# EAGLE schematic Full (EAGLE 9.6.2)
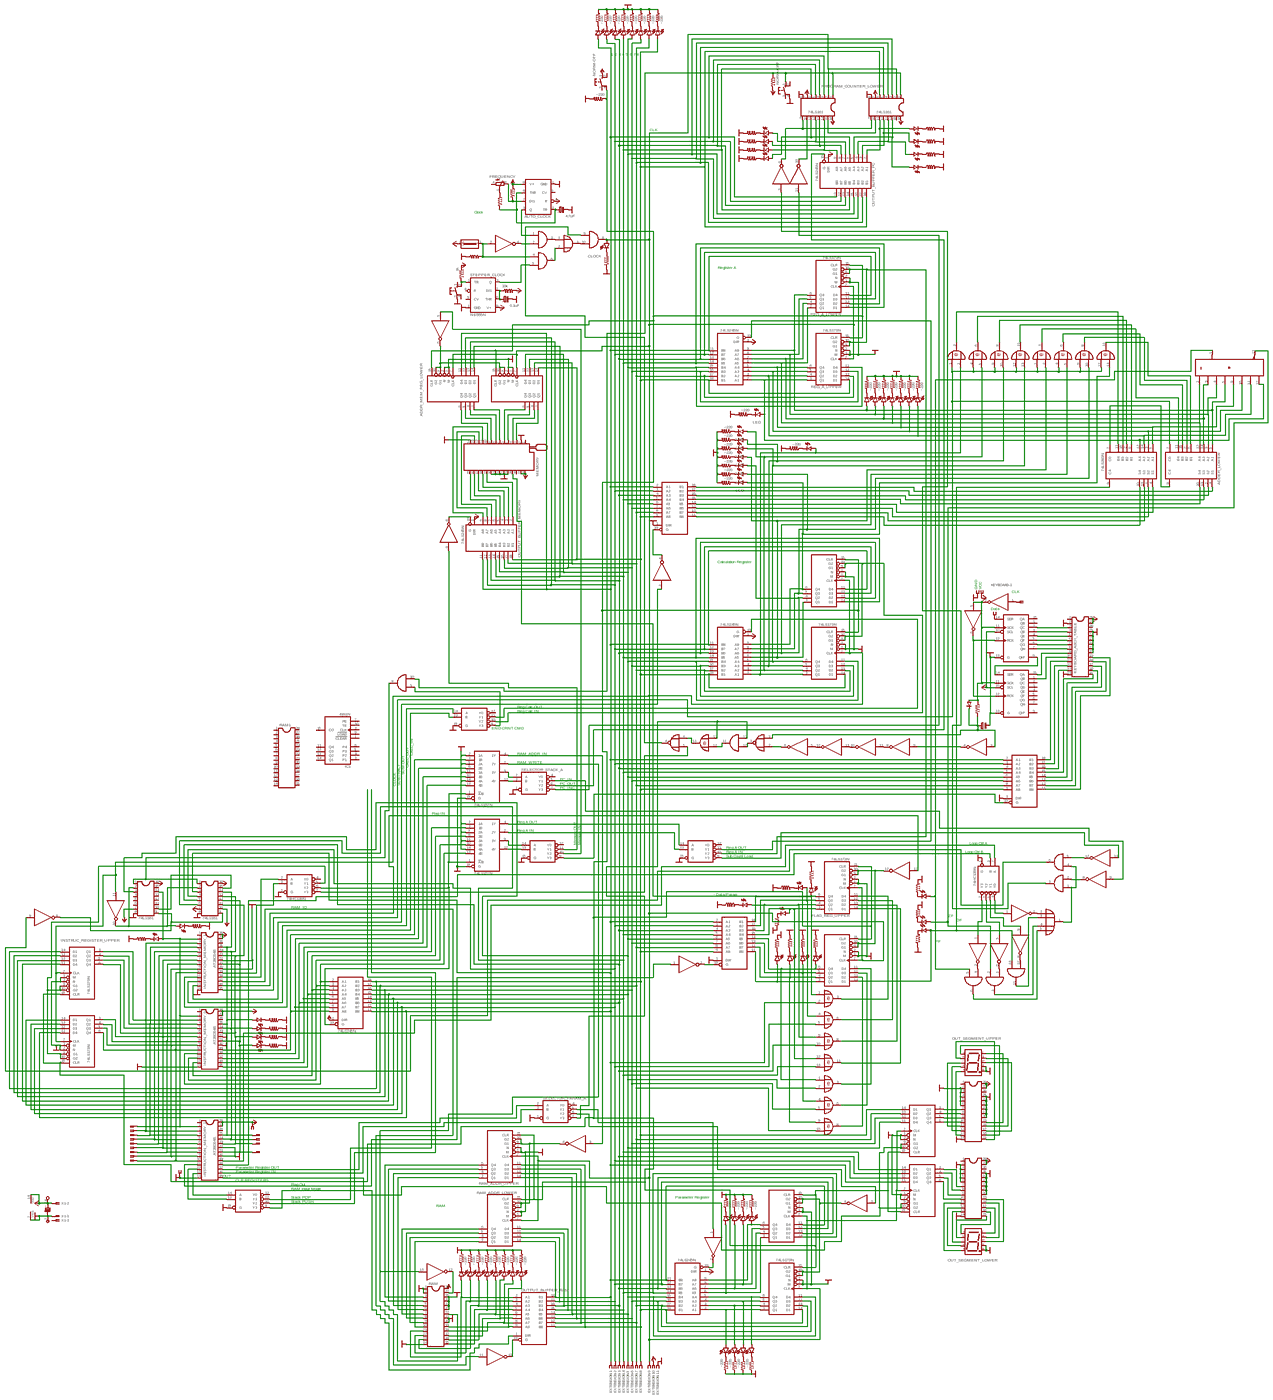
[diagram p0: schematic, sheet 1, overview]
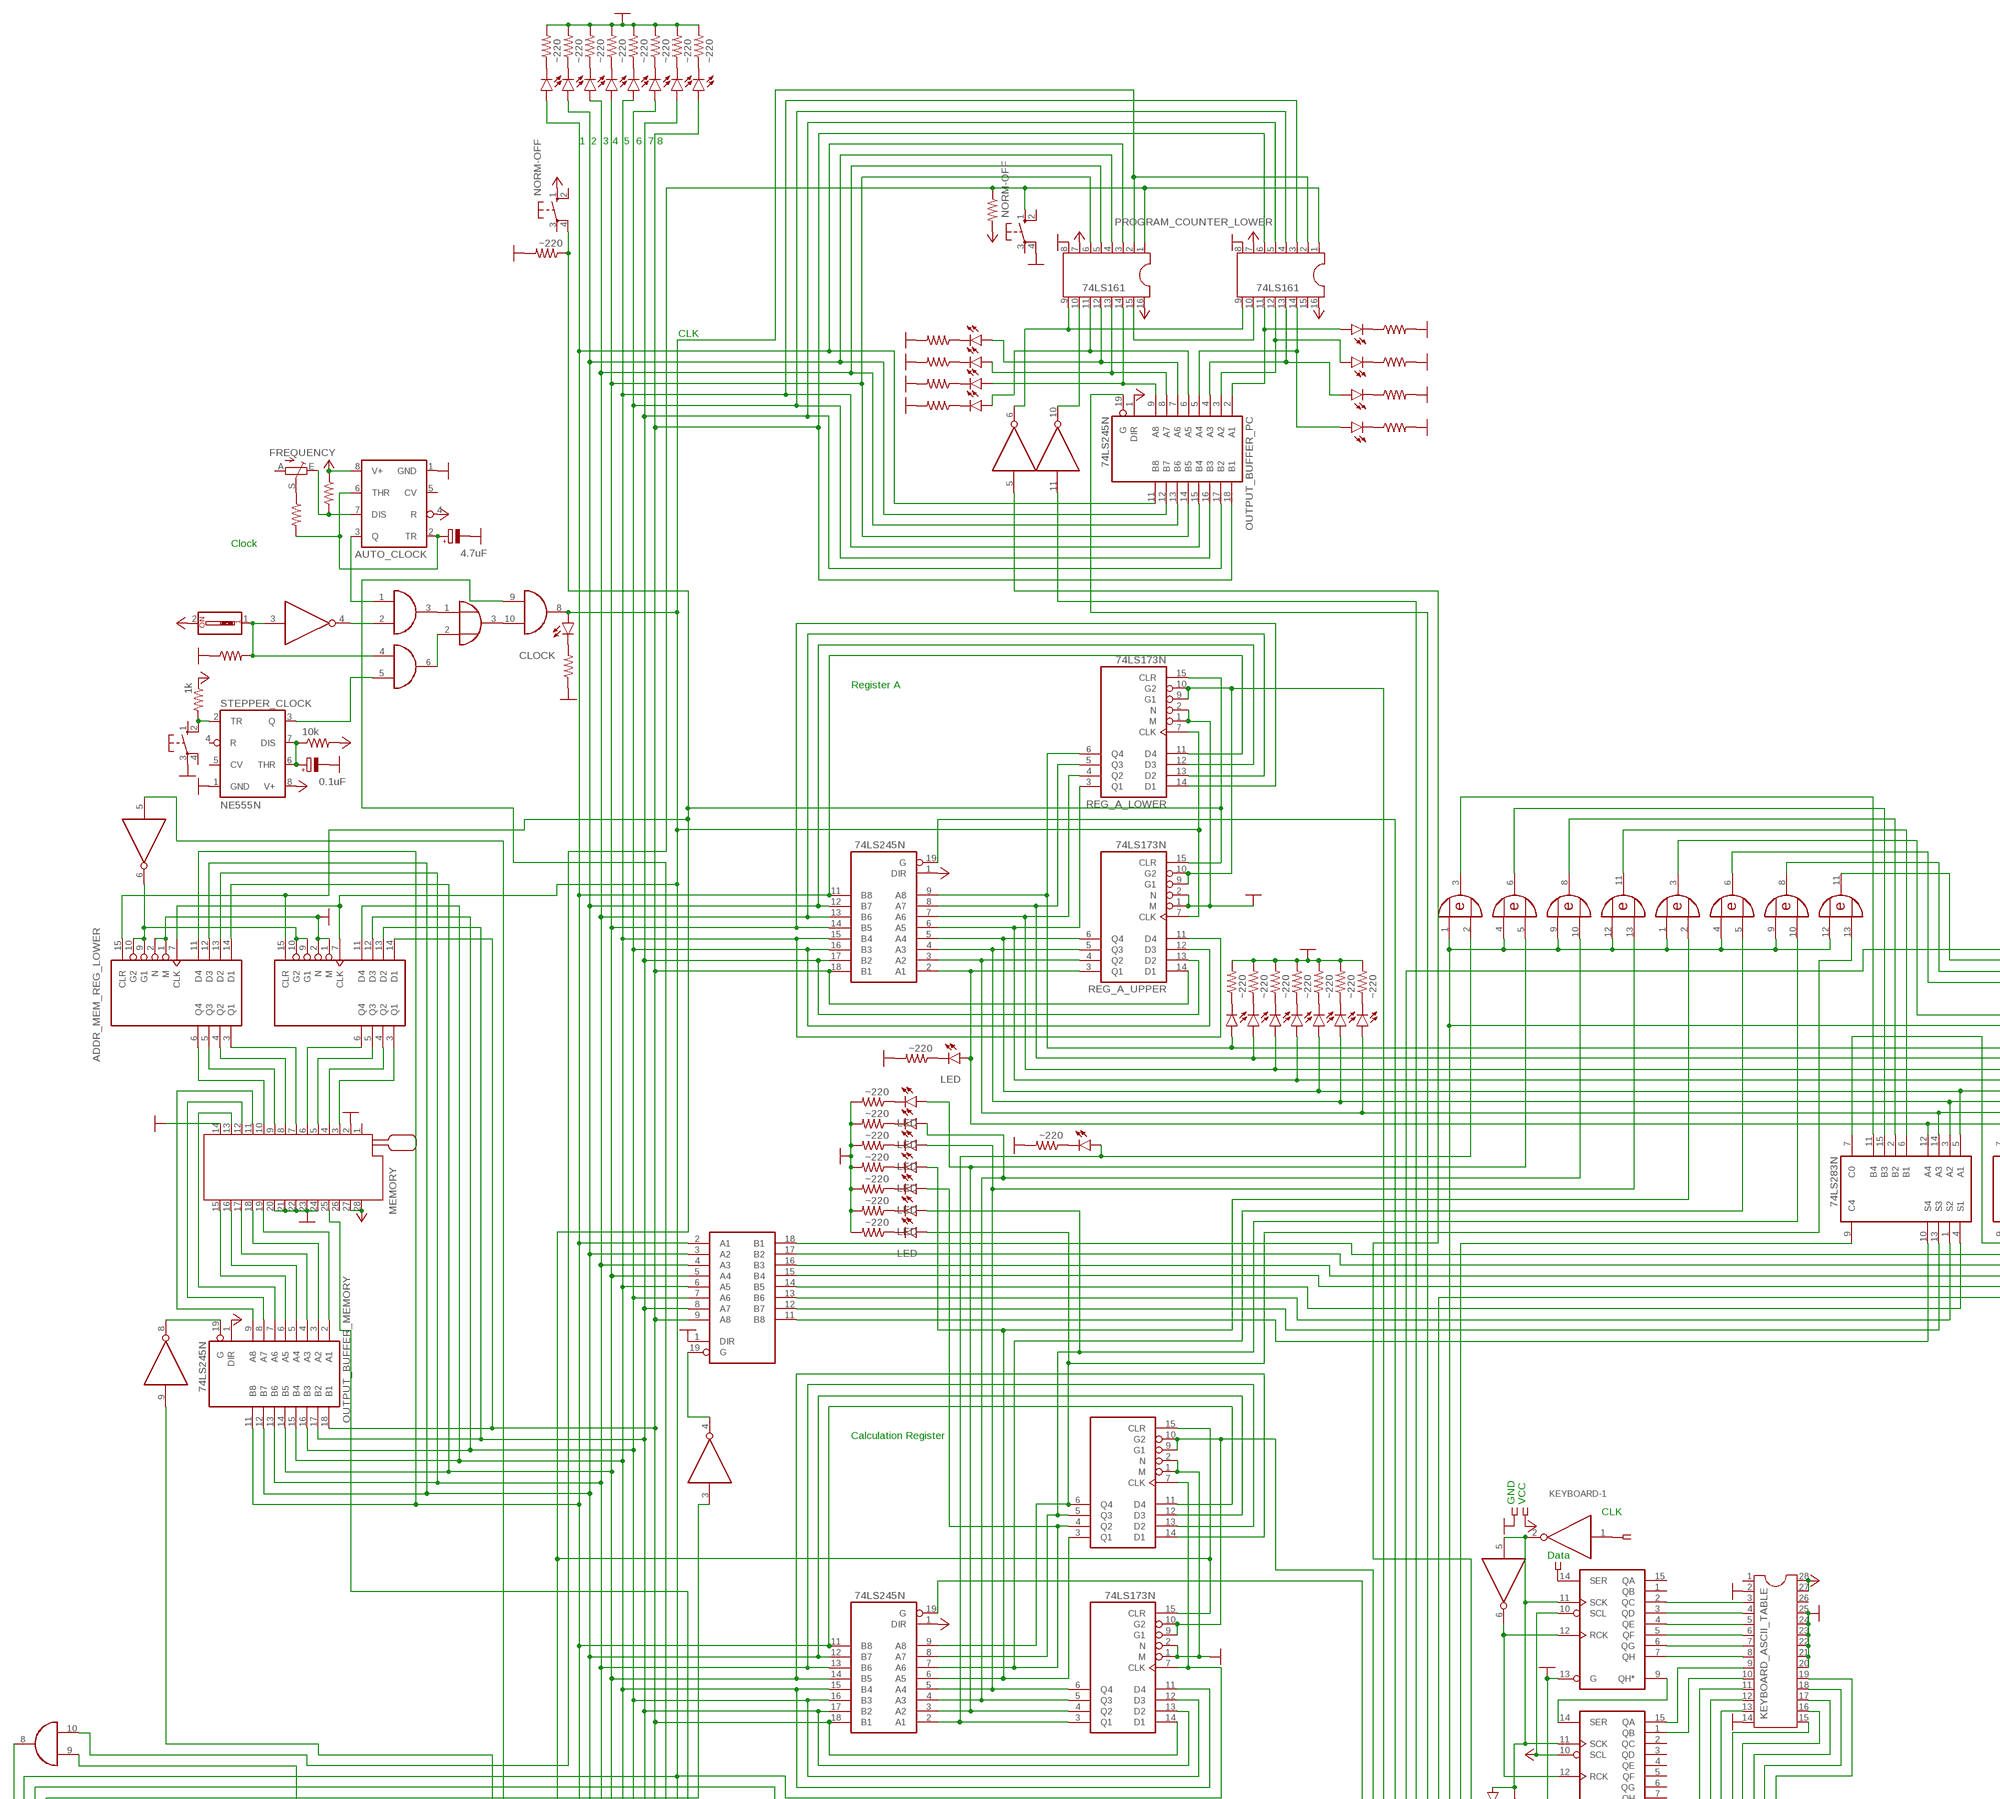
[diagram p1: schematic, sheet 1, part 1 of 4]
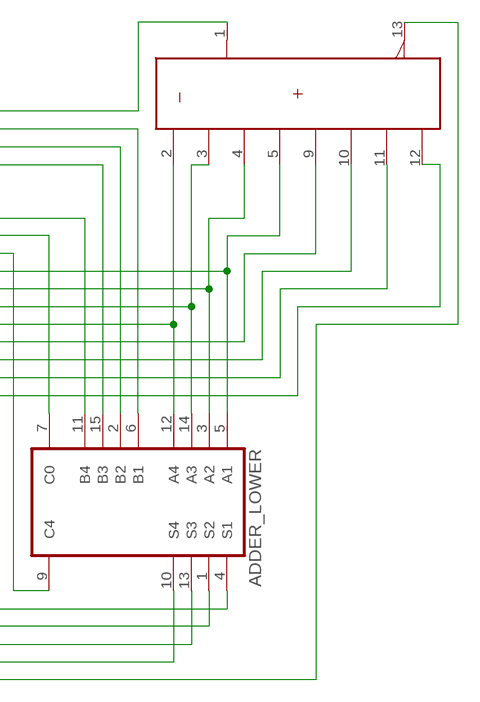
[diagram p2: schematic, sheet 1, part 2 of 4]
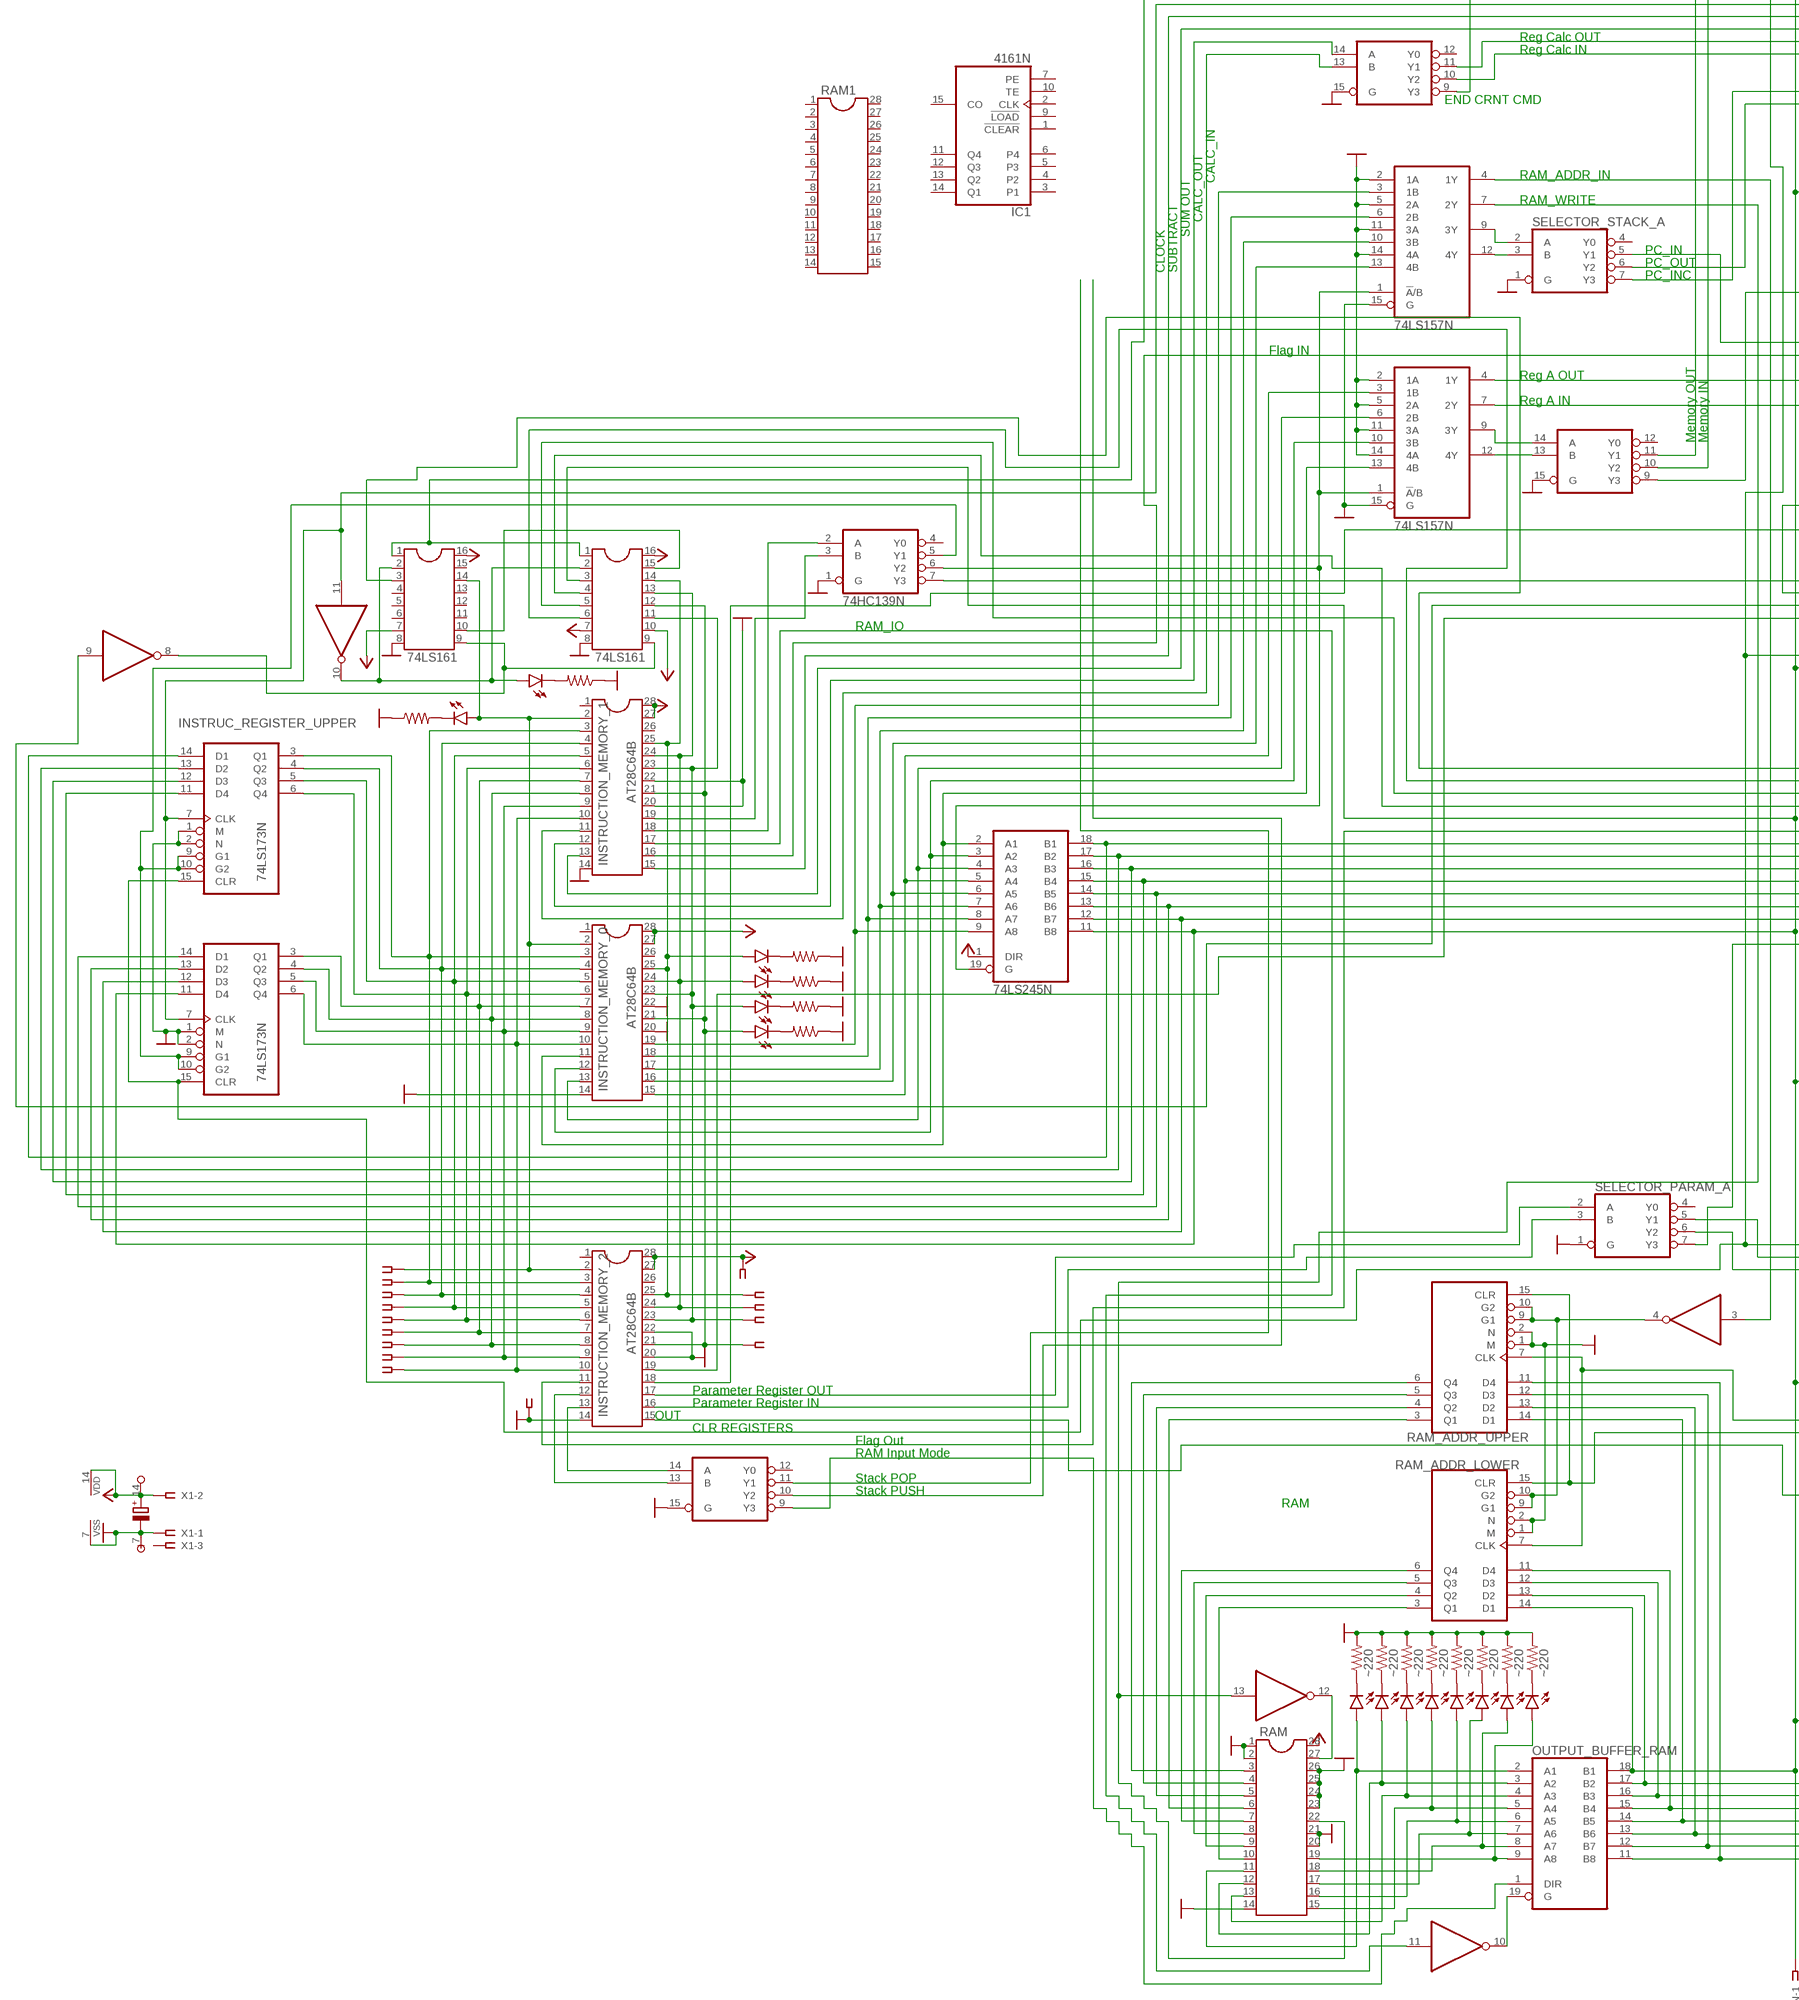
[diagram p3: schematic, sheet 1, part 3 of 4]
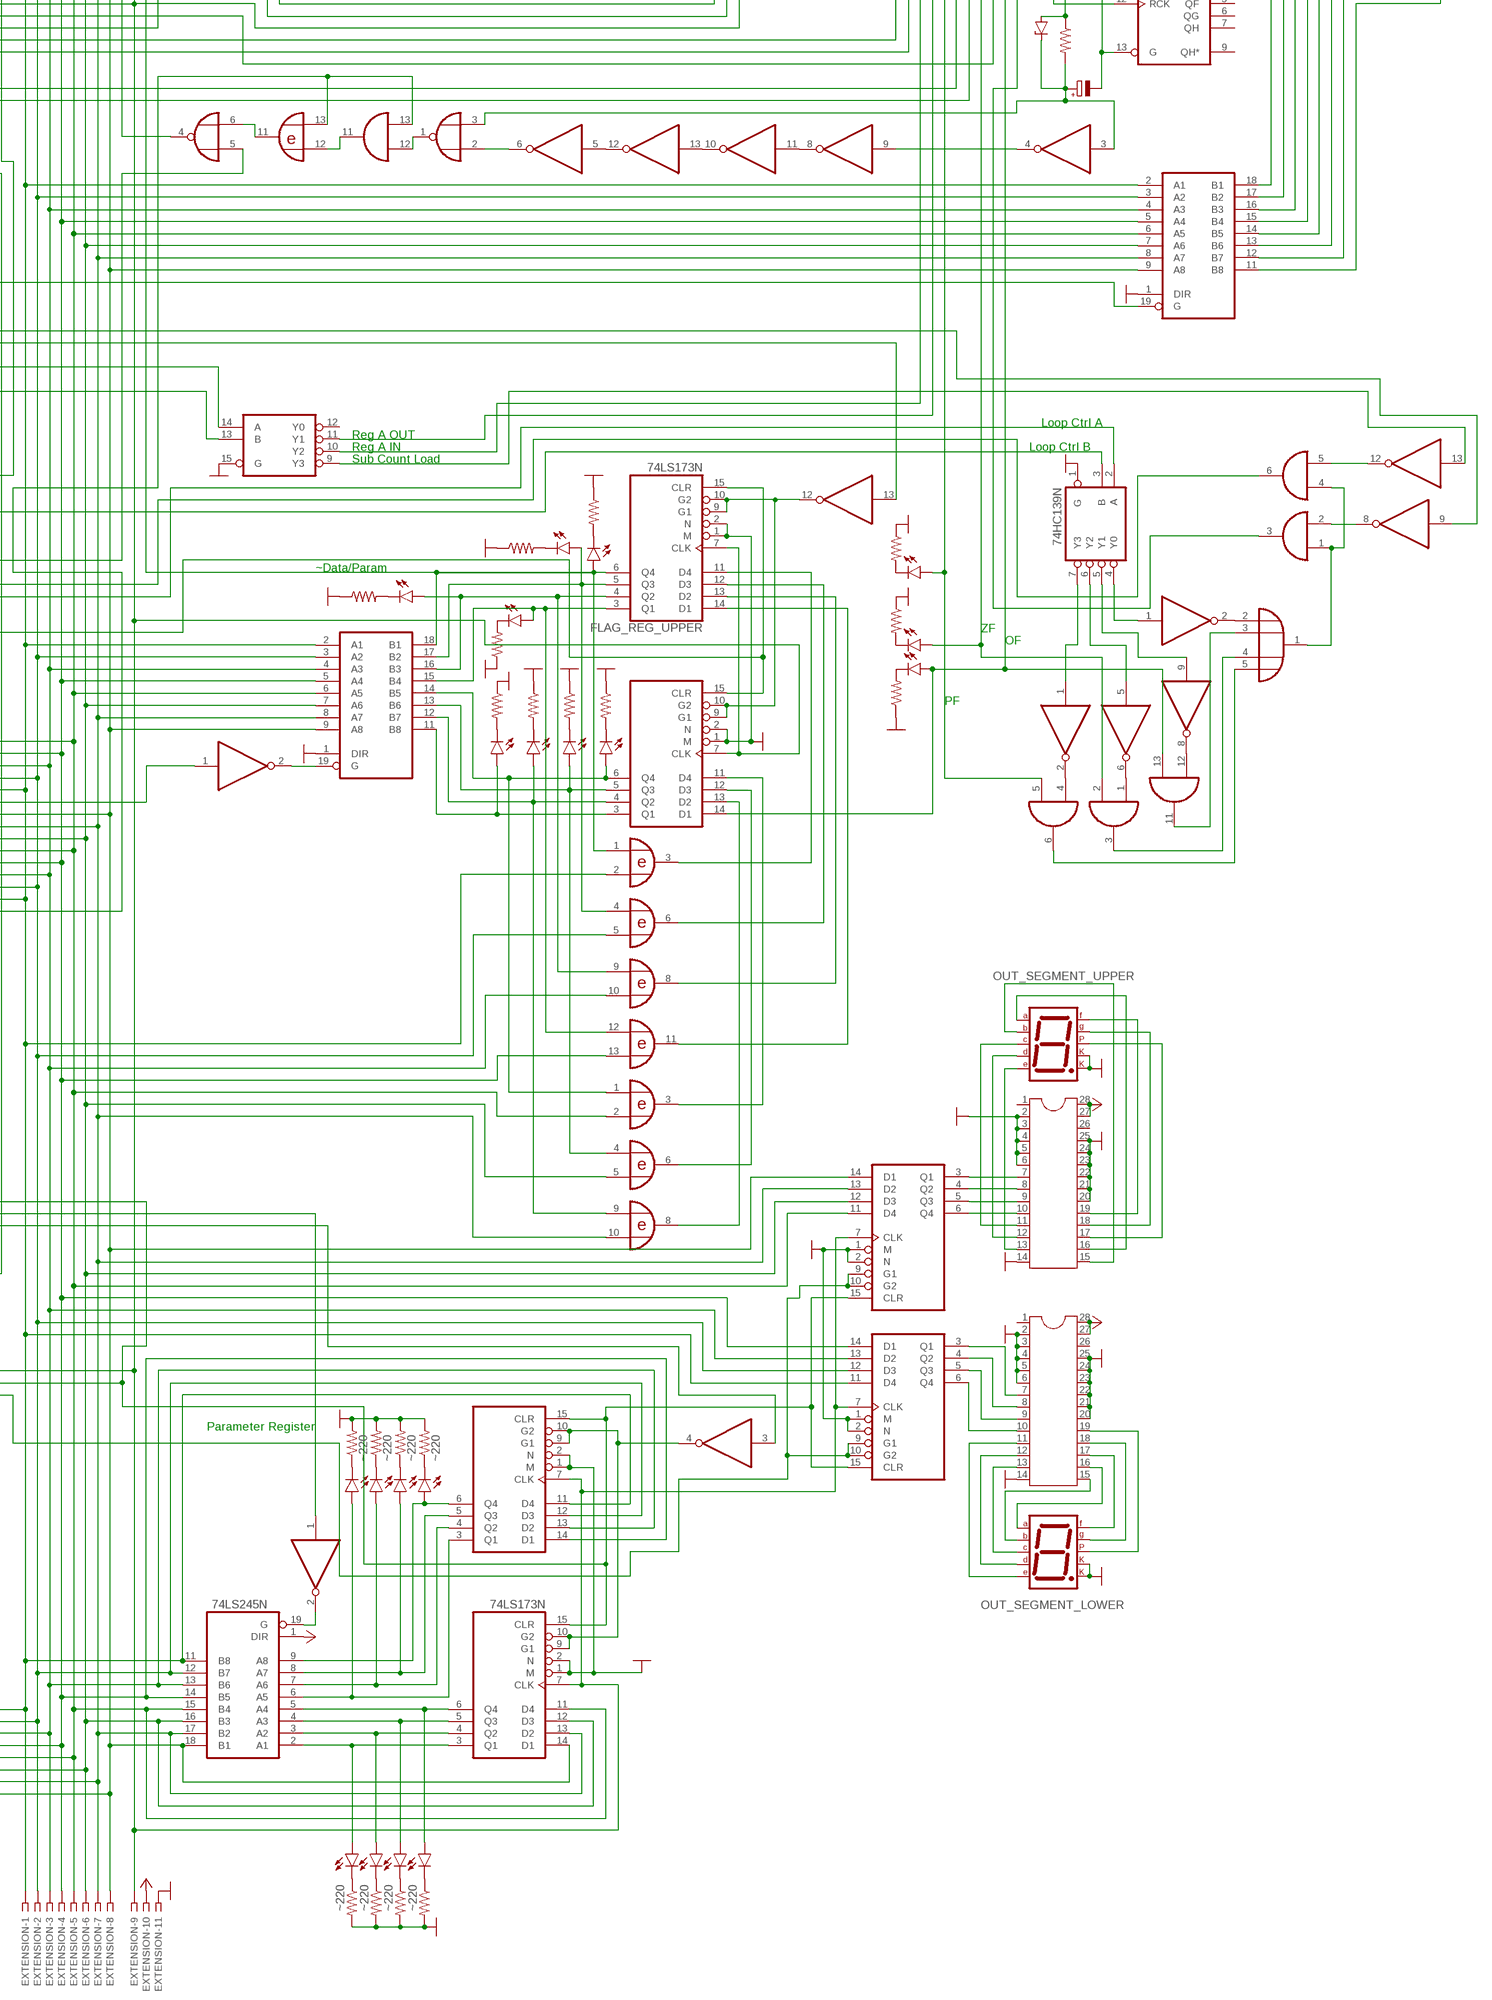
[diagram p4: schematic, sheet 1, part 4 of 4]

## Parts
4_INP_OR_GATE  4072N  [DIL14]
ADDER_LOWER  74LS283N  [DIL16]
ADDER_UPPER  74LS283N  [DIL16]
ADDR_MEM_REG_LOWER  74LS173N  [DIL16]
ADDR_MEM_REG_UPPER  74LS173N  [DIL16]
AND_GATE3_  74LS08N  [DIL14]
AND_GATE4_  74LS08N  [DIL14]
AND_GATE_  74LS08N  [DIL14]
AUTO_CLOCK  NE555N  [DIL08]
C1  4.7uF  CPOL-EUE2-5  [E2-5]
C2  0.1uF  CPOL-EUE2-5  [E2-5]
C3  0.1uF  CPOL-EUE2-5  [E2-5]
C4  0.1uF  CPOL-EUE2-5  [E2-5]
CLK_MODE  SWITCH  SW_DIP-1  [EDG-01]
CLK_TRIGGER  SWITCH  10-XX  [B3F-10XX]
CLOCK  Yellow  LED5MM  [LED5MM]
D1  1N4728  [DO41Z10]
DATABUS_1  LED  LED5MM  [LED5MM]
DATABUS_2  LED  LED5MM  [LED5MM]
DATABUS_3  LED  LED5MM  [LED5MM]
DATABUS_4  LED  LED5MM  [LED5MM]
DATABUS_5  LED  LED5MM  [LED5MM]
DATABUS_6  LED  LED5MM  [LED5MM]
DATABUS_7  LED  LED5MM  [LED5MM]
DATABUS_8  LED  LED5MM  [LED5MM]
EXTENSION  SSW-111-02-G-S  [SSW-111-02-G-S]
FLAG_1  LED  LED5MM  [LED5MM]
FLAG_2  LED  LED5MM  [LED5MM]
FLAG_3  LED  LED5MM  [LED5MM]
FLAG_4  LED  LED5MM  [LED5MM]
FLAG_5  LED  LED5MM  [LED5MM]
FLAG_6  LED  LED5MM  [LED5MM]
FLAG_7  LED  LED5MM  [LED5MM]
FLAG_8  LED  LED5MM  [LED5MM]
FLAG_REG_LOWER  74LS173N  [DIL16]
FLAG_REG_UPPER  74LS173N  [DIL16]
FREQUENCY  100k  TRIM_EU-RJ9W  [RJ9W]
IC1  4161N  [DIL16]
INSTRUC_REGISTER_LOWER  74LS173N  [DIL16]
INSTRUC_REGISTER_UPPER  74LS173N  [DIL16]
INSTRUCTION_MEMORY_0  AT28C64B  DIL28  [DIL28-6]
INSTRUCTION_MEMORY_1  AT28C64B  DIL28  [DIL28-6]
INSTRUCTION_MEMORY_2  AT28C64B  DIL28  [DIL28-6]
INSTRUCTIONS_EXTENSION  SSW-115-02-G-S  [SSW-115-02-G-S]
INVERTED_CLK_LED  LED  LED5MM  [LED5MM]
KEYBOARD  SSW-104-02-G-S  [SSW-104-02-G-S]
KEYBOARD_ASCII_TABLE  AT28C64B  DIL28  [DIL28-6]
KEYBOARD_SHIFT_LOWER  74LS595N  [DIL16]
KEYBOARD_SHIFT_UPPER  74LS595N  [DIL16]
LED_A_REG_1  LED  LED5MM  [LED5MM]
LED_A_REG_2  LED  LED5MM  [LED5MM]
LED_A_REG_3  LED  LED5MM  [LED5MM]
LED_A_REG_4  LED  LED5MM  [LED5MM]
LED_A_REG_5  LED  LED5MM  [LED5MM]
LED_A_REG_6  LED  LED5MM  [LED5MM]
LED_A_REG_7  LED  LED5MM  [LED5MM]
LED_A_REG_8  LED  LED5MM  [LED5MM]
LED_B_REG_1  LED  LED5MM  [LED5MM]
LED_B_REG_2  LED  LED5MM  [LED5MM]
LED_B_REG_3  LED  LED5MM  [LED5MM]
LED_B_REG_4  LED  LED5MM  [LED5MM]
LED_B_REG_5  LED  LED5MM  [LED5MM]
LED_B_REG_6  LED  LED5MM  [LED5MM]
LED_B_REG_7  LED  LED5MM  [LED5MM]
LED_B_REG_8  LED  LED5MM  [LED5MM]
MEMORY  228-1277-00-0602J  [228-1277-00-0602J]
MICRO_COUNTER_LOWER  74LS161  DIL16  [DIL16]
MICRO_COUNTER_UPPER  74LS161  DIL16  [DIL16]
NOR_GATE_  74LS02N  [DIL14]
NOT_GATE1_  74LS04N  [DIL14]
NOT_GATE2_  74LS04N  [DIL14]
NOT_GATE3_  74LS04N  [DIL14]
NOT_GATE4_  74LS04N  [DIL14]
NOT_GATE_  74LS04N  [DIL14]
OR_GATE_  74LS32N  [DIL14]
OUT_REG_LOWER  74LS173N  [DIL16]
OUT_REG_UPPER  74LS173N  [DIL16]
OUT_ROM_LOWER  AT28C64B  DIL28  [DIL28-6]
OUT_ROM_UPPER  AT28C64B  DIL28  [DIL28-6]
OUT_SEGMENT_LOWER  LED  7SEG-CK  [7SEG-13]
OUT_SEGMENT_UPPER  LED  7SEG-CK  [7SEG-13]
OUTPUT_BUFFER_ALU  74LS245N  [DIL20]
OUTPUT_BUFFER_CALC_REG  74LS245N  [DIL20]
OUTPUT_BUFFER_FLAGS  74HC245N  [DIL20]
OUTPUT_BUFFER_INSTRUCTION  74LS245N  [DIL20]
OUTPUT_BUFFER_KEYBOARD  74LS245N  [DIL20]
OUTPUT_BUFFER_MEMORY  74LS245N  [DIL20]
OUTPUT_BUFFER_PARAM_REG  74LS245N  [DIL20]
OUTPUT_BUFFER_PC  74LS245N  [DIL20]
OUTPUT_BUFFER_RAM  74HC245N  [DIL20]
OUTPUT_BUFFER_REG_A  74LS245N  [DIL20]
OVERFLOW_FLAG  LED  LED5MM  [LED5MM]
PARAM_LED_1  LED3MM  [LED3MM]
PARAM_LED_2  LED3MM  [LED3MM]
PARAM_LED_3  LED3MM  [LED3MM]
PARAM_LED_4  LED3MM  [LED3MM]
PARAM_LED_5  LED3MM  [LED3MM]
PARAM_LED_6  LED3MM  [LED3MM]
PARAM_LED_7  LED3MM  [LED3MM]
PARAM_LED_8  LED3MM  [LED3MM]
PC_1  LED5MM  [LED5MM]
PC_2  LED5MM  [LED5MM]
PC_3  LED5MM  [LED5MM]
PC_4  LED5MM  [LED5MM]
PC_5  LED5MM  [LED5MM]
PC_6  LED5MM  [LED5MM]
PC_7  LED5MM  [LED5MM]
PC_8  LED5MM  [LED5MM]
POSITIVE_FLAG  LED  LED5MM  [LED5MM]
PROGRAM_COUNTER_LOWER  74LS161  DIL16  [DIL16]
PROGRAM_COUNTER_UPPER  74LS161  DIL16  [DIL16]
R1  1k  R-US_0204/7  [0204/7]
R2  1k  R-US_0204/7  [0204/7]
R3  10k  R-US_0204/7  [0204/7]
R4  220  R-US_0204/7  [0204/7]
R5  ~220  R-US_0204/7  [0204/7]
R6  ~220  R-US_0204/7  [0204/7]
R7  220  R-US_0204/7  [0204/7]
R8  ~220  R-US_0204/7  [0204/7]
R9  ~220  R-US_0204/7  [0204/7]
R10  ~220  R-US_0204/7  [0204/7]
R11  ~220  R-US_0204/7  [0204/7]
R12  ~220  R-US_0204/7  [0204/7]
R13  ~220  R-US_0204/7  [0204/7]
R14  ~220  R-US_0204/7  [0204/7]
R15  ~220  R-US_0204/7  [0204/7]
R16  ~220  R-US_0204/7  [0204/7]
R17  ~220  R-US_0204/7  [0204/7]
R18  ~220  R-US_0204/7  [0204/7]
R19  ~220  R-US_0204/7  [0204/7]
R20  ~220  R-US_0204/7  [0204/7]
R21  ~220  R-US_0204/7  [0204/7]
R22  ~220  R-US_0204/7  [0204/7]
R23  ~220  R-US_0204/7  [0204/7]
R24  ~220  R-US_0204/7  [0204/7]
R25  ~220  R-US_0204/7  [0204/7]
R26  ~220  R-US_0204/7  [0204/7]
R27  ~220  R-US_0204/7  [0204/7]
R28  ~220  R-US_0204/7  [0204/7]
R29  ~220  R-US_0204/7  [0204/7]
R30  ~220  R-US_0204/7  [0204/7]
R31  ~220  R-US_0204/7  [0204/7]
R32  ~220  R-US_0204/7  [0204/7]
R33  ~220  R-US_0204/7  [0204/7]
R34  ~220  R-US_0204/7  [0204/7]
R35  ~220  R-US_0204/7  [0204/7]
R36  ~220  R-US_0204/7  [0204/7]
R37  ~220  R-US_0204/7  [0204/7]
R38  ~220  R-US_0204/7  [0204/7]
R39  ~220  R-US_0204/7  [0204/7]
R40  ~220  R-US_0204/7  [0204/7]
R41  ~220  R-US_0204/7  [0204/7]
R42  ~220  R-US_0204/7  [0204/7]
R43  ~220  R-US_0204/7  [0204/7]
R44  ~220  R-US_0204/7  [0204/7]
R45  ~220  R-US_0204/7  [0204/7]
R53  ~220  R-US_0204/7  [0204/7]
R54  ~220  R-US_0204/7  [0204/7]
R55  ~220  R-US_0204/7  [0204/7]
R56  ~220  R-US_0204/7  [0204/7]
R57  ~220  R-US_0204/7  [0204/7]
R58  ~220  R-US_0204/7  [0204/7]
R59  ~220  R-US_0204/7  [0204/7]
R60  ~220  R-US_0204/7  [0204/7]
R61  ~220  R-US_0204/7  [0204/7]
R62  ~220  R-US_0204/7  [0204/7]
R63  ~220  R-US_0204/7  [0204/7]
R64  ~220  R-US_0204/7  [0204/7]
R65  ~220  R-US_0204/7  [0204/7]
R66  ~220  R-US_0204/7  [0204/7]
R67  ~220  R-US_0204/7  [0204/7]
R68  ~220  R-US_0204/7  [0204/7]
R69  ~220  R-US_0204/7  [0204/7]
R70  ~220  R-US_0204/7  [0204/7]
R71  ~220  R-US_0204/7  [0204/7]
R72  ~220  R-US_0204/7  [0204/7]
R73  ~220  R-US_0204/7  [0204/7]
R74  ~220  R-US_0204/7  [0204/7]
R75  ~220  R-US_0204/7  [0204/7]
R76  ~220  R-US_0204/7  [0204/7]
R77  ~220  R-US_0204/7  [0204/7]
R78  ~220  R-US_0204/7  [0204/7]
R79  ~220  R-US_0204/7  [0204/7]
R80  ~220  R-US_0204/7  [0204/7]
R81  ~220  R-US_0204/7  [0204/7]
RAM  71256SA15TPG  DIL28-3  [DIL28-3]
RAM1  71256SA15TPG  DIL28-3  [DIL28-3]
RAM_ADDR_LOWER  74LS173N  [DIL16]
RAM_ADDR_UPPER  74LS173N  [DIL16]
RAM_LED_1  LED3MM  [LED3MM]
RAM_LED_2  LED3MM  [LED3MM]
RAM_LED_3  LED3MM  [LED3MM]
RAM_LED_4  LED3MM  [LED3MM]
RAM_LED_5  LED3MM  [LED3MM]
RAM_LED_6  LED3MM  [LED3MM]
RAM_LED_7  LED3MM  [LED3MM]
RAM_LED_8  LED3MM  [LED3MM]
REG_A_LOWER  74LS173N  [DIL16]
REG_A_UPPER  74LS173N  [DIL16]
REG_CALC_LOWER  74LS173N  [DIL16]
REG_CALC_UPPER  74LS173N  [DIL16]
REG_PARAM_LOWER  74LS173N  [DIL16]
REG_PARAM_UPPER  74LS173N  [DIL16]
RESET_PC  NORM-OFF  10-XX  [B3F-10XX]
RESET_REGS  NORM-OFF  10-XX  [B3F-10XX]
SELECTOR_BRANCH_  74HC139N  [DIL16]
SELECTOR_INSRUCTION_LOWER  74LS157N  [DIL16]
SELECTOR_INSRUCTION_UPPER  74LS157N  [DIL16]
SELECTOR_LOGIC_  74HC139N  [DIL16]
SELECTOR_PARAM_  74LS139N  [DIL16]
SELECTOR_STACK_  74LS139N  [DIL16]
STEPPER_CLOCK  NE555N  [DIL08]
SUBTRACT_INVRTR_LOWER_  74LS86N  [DIL14]
SUBTRACT_INVRTR_UPPER_  74LS86N  [DIL14]
USTEP_1  LED  LED5MM  [LED5MM]
USTEP_2  LED  LED5MM  [LED5MM]
USTEP_3  LED  LED5MM  [LED5MM]
USTEP_4  LED  LED5MM  [LED5MM]
USTEP_5  LED  LED5MM  [LED5MM]
X1  SSW-103-02-G-S  [SSW-103-02-G-S]
XOR_GATE_1  74LS86N  [DIL14]
XOR_GATE_2  74LS86N  [DIL14]
ZERO_FLAG  220  LED5MM  [LED5MM]
ZERO_POS_FLAG_IDENTIFIER  744078N  [DIL14]

## Nets
1_PLACE1 [Databus]: ADDR_MEM_REG_LOWER.11(D4) DATABUS_1.A EXTENSION.1 INSTRUC_REGISTER_LOWER.11(D4) MICRO_COUNTER_LOWER.3 OUT_REG_LOWER.11(D4) OUTPUT_BUFFER_ALU.2(A1) OUTPUT_BUFFER_CALC_REG.11(B8) OUTPUT_BUFFER_FLAGS.2(A1) OUTPUT_BUFFER_INSTRUCTION.11(B8) OUTPUT_BUFFER_KEYBOARD.2(A1) OUTPUT_BUFFER_MEMORY.11(B8) OUTPUT_BUFFER_PARAM_REG.11(B8) OUTPUT_BUFFER_PC.11(B8) OUTPUT_BUFFER_RAM.18(B1) OUTPUT_BUFFER_REG_A.11(B8) PROGRAM_COUNTER_LOWER.3 RAM_ADDR_LOWER.14(D1) REG_A_LOWER.11(D4) REG_CALC_LOWER.11(D4) REG_PARAM_LOWER.11(D4) XOR_GATE_1.2(A:I1)
2_PLACE [Databus]: ADDR_MEM_REG_LOWER.12(D3) DATABUS_2.A EXTENSION.2 INSTRUC_REGISTER_LOWER.12(D3) MICRO_COUNTER_LOWER.4 OUT_REG_LOWER.12(D3) OUTPUT_BUFFER_ALU.3(A2) OUTPUT_BUFFER_CALC_REG.12(B7) OUTPUT_BUFFER_FLAGS.3(A2) OUTPUT_BUFFER_INSTRUCTION.12(B7) OUTPUT_BUFFER_KEYBOARD.3(A2) OUTPUT_BUFFER_MEMORY.12(B7) OUTPUT_BUFFER_PARAM_REG.12(B7) OUTPUT_BUFFER_PC.12(B7) OUTPUT_BUFFER_RAM.17(B2) OUTPUT_BUFFER_REG_A.12(B7) PROGRAM_COUNTER_LOWER.4 RAM_ADDR_LOWER.13(D2) REG_A_LOWER.12(D3) REG_CALC_LOWER.12(D3) REG_PARAM_LOWER.12(D3) XOR_GATE_1.5(B:I1)
4_PLACE [Databus]: ADDR_MEM_REG_LOWER.13(D2) DATABUS_3.A EXTENSION.3 INSTRUC_REGISTER_LOWER.13(D2) MICRO_COUNTER_LOWER.5 OUT_REG_LOWER.13(D2) OUTPUT_BUFFER_ALU.4(A3) OUTPUT_BUFFER_CALC_REG.13(B6) OUTPUT_BUFFER_FLAGS.4(A3) OUTPUT_BUFFER_INSTRUCTION.13(B6) OUTPUT_BUFFER_KEYBOARD.4(A3) OUTPUT_BUFFER_MEMORY.13(B6) OUTPUT_BUFFER_PARAM_REG.13(B6) OUTPUT_BUFFER_PC.13(B6) OUTPUT_BUFFER_RAM.16(B3) OUTPUT_BUFFER_REG_A.13(B6) PROGRAM_COUNTER_LOWER.5 RAM_ADDR_LOWER.12(D3) REG_A_LOWER.13(D2) REG_CALC_LOWER.13(D2) REG_PARAM_LOWER.13(D2) XOR_GATE_1.10(C:I1)
8_PLACE [Databus]: ADDR_MEM_REG_LOWER.14(D1) DATABUS_4.A EXTENSION.4 INSTRUC_REGISTER_LOWER.14(D1) MICRO_COUNTER_LOWER.6 OUT_REG_LOWER.14(D1) OUTPUT_BUFFER_ALU.5(A4) OUTPUT_BUFFER_CALC_REG.14(B5) OUTPUT_BUFFER_FLAGS.5(A4) OUTPUT_BUFFER_INSTRUCTION.14(B5) OUTPUT_BUFFER_KEYBOARD.5(A4) OUTPUT_BUFFER_MEMORY.14(B5) OUTPUT_BUFFER_PARAM_REG.14(B5) OUTPUT_BUFFER_PC.14(B5) OUTPUT_BUFFER_RAM.15(B4) OUTPUT_BUFFER_REG_A.14(B5) PROGRAM_COUNTER_LOWER.6 RAM_ADDR_LOWER.11(D4) REG_A_LOWER.14(D1) REG_CALC_LOWER.14(D1) REG_PARAM_LOWER.14(D1) XOR_GATE_1.13(D:I1)
16_PLACE [Databus]: ADDR_MEM_REG_UPPER.11(D4) DATABUS_5.A EXTENSION.5 INSTRUC_REGISTER_UPPER.11(D4) MICRO_COUNTER_UPPER.3 OUT_REG_UPPER.11(D4) OUTPUT_BUFFER_ALU.6(A5) OUTPUT_BUFFER_CALC_REG.15(B4) OUTPUT_BUFFER_FLAGS.6(A5) OUTPUT_BUFFER_INSTRUCTION.15(B4) OUTPUT_BUFFER_KEYBOARD.6(A5) OUTPUT_BUFFER_MEMORY.15(B4) OUTPUT_BUFFER_PARAM_REG.15(B4) OUTPUT_BUFFER_PC.15(B4) OUTPUT_BUFFER_RAM.14(B5) OUTPUT_BUFFER_REG_A.15(B4) PROGRAM_COUNTER_UPPER.3 RAM_ADDR_UPPER.14(D1) REG_A_UPPER.11(D4) REG_CALC_UPPER.11(D4) REG_PARAM_UPPER.11(D4) XOR_GATE_2.2(A:I1)
32_PLACE [Databus]: ADDR_MEM_REG_UPPER.12(D3) DATABUS_6.A EXTENSION.6 INSTRUC_REGISTER_UPPER.12(D3) OUT_REG_UPPER.12(D3) OUTPUT_BUFFER_ALU.7(A6) OUTPUT_BUFFER_CALC_REG.16(B3) OUTPUT_BUFFER_FLAGS.7(A6) OUTPUT_BUFFER_INSTRUCTION.16(B3) OUTPUT_BUFFER_KEYBOARD.7(A6) OUTPUT_BUFFER_MEMORY.16(B3) OUTPUT_BUFFER_PARAM_REG.16(B3) OUTPUT_BUFFER_PC.16(B3) OUTPUT_BUFFER_RAM.13(B6) OUTPUT_BUFFER_REG_A.16(B3) PROGRAM_COUNTER_UPPER.4 RAM_ADDR_UPPER.13(D2) REG_A_UPPER.12(D3) REG_CALC_UPPER.12(D3) REG_PARAM_UPPER.12(D3) XOR_GATE_2.5(B:I1)
64_PLACE [Databus]: ADDR_MEM_REG_UPPER.13(D2) DATABUS_7.A EXTENSION.7 INSTRUC_REGISTER_UPPER.13(D2) OUT_REG_UPPER.13(D2) OUTPUT_BUFFER_ALU.8(A7) OUTPUT_BUFFER_CALC_REG.17(B2) OUTPUT_BUFFER_FLAGS.8(A7) OUTPUT_BUFFER_INSTRUCTION.17(B2) OUTPUT_BUFFER_KEYBOARD.8(A7) OUTPUT_BUFFER_MEMORY.17(B2) OUTPUT_BUFFER_PARAM_REG.17(B2) OUTPUT_BUFFER_PC.17(B2) OUTPUT_BUFFER_RAM.12(B7) OUTPUT_BUFFER_REG_A.17(B2) PROGRAM_COUNTER_UPPER.5 RAM_ADDR_UPPER.12(D3) REG_A_UPPER.13(D2) REG_CALC_UPPER.13(D2) REG_PARAM_UPPER.13(D2) XOR_GATE_2.10(C:I1)
128_PLACE [Databus]: ADDR_MEM_REG_UPPER.14(D1) DATABUS_8.A EXTENSION.8 INSTRUC_REGISTER_UPPER.14(D1) OUT_REG_UPPER.14(D1) OUTPUT_BUFFER_ALU.9(A8) OUTPUT_BUFFER_CALC_REG.18(B1) OUTPUT_BUFFER_FLAGS.9(A8) OUTPUT_BUFFER_INSTRUCTION.18(B1) OUTPUT_BUFFER_KEYBOARD.9(A8) OUTPUT_BUFFER_MEMORY.18(B1) OUTPUT_BUFFER_PARAM_REG.18(B1) OUTPUT_BUFFER_PC.18(B1) OUTPUT_BUFFER_RAM.11(B8) OUTPUT_BUFFER_REG_A.18(B1) PROGRAM_COUNTER_UPPER.6 RAM_ADDR_UPPER.11(D4) REG_A_UPPER.14(D1) REG_CALC_UPPER.14(D1) REG_PARAM_UPPER.14(D1)
>0_FLAG: AND_GATE4_.5(B:I1) POSITIVE_FLAG.A ZERO_POS_FLAG_IDENTIFIER.1(Y)
CALC_IN: REG_CALC_LOWER.9(G1) REG_CALC_LOWER.10(G2) REG_CALC_UPPER.9(G1) REG_CALC_UPPER.10(G2) SELECTOR_LOGIC_.10(B:Y2)
CALC_OUT: OUTPUT_BUFFER_CALC_REG.19(G) SELECTOR_LOGIC_.11(B:Y1)
CLOCK: ADDR_MEM_REG_LOWER.7(CLK) ADDR_MEM_REG_UPPER.7(CLK) AND_GATE_.8(C:O) CLOCK.A EXTENSION.9 FLAG_REG_LOWER.7(CLK) FLAG_REG_UPPER.7(CLK) INSTRUC_REGISTER_LOWER.7(CLK) INSTRUC_REGISTER_UPPER.7(CLK) NOT_GATE1_.11(E:I) OUT_REG_LOWER.7(CLK) OUT_REG_UPPER.7(CLK) PROGRAM_COUNTER_LOWER.2 PROGRAM_COUNTER_UPPER.2 RAM_ADDR_LOWER.7(CLK) RAM_ADDR_UPPER.7(CLK) REG_A_LOWER.7(CLK) REG_A_UPPER.7(CLK) REG_CALC_LOWER.7(CLK) REG_CALC_UPPER.7(CLK) REG_PARAM_LOWER.7(CLK) REG_PARAM_UPPER.7(CLK)
CLR_REG: ADDR_MEM_REG_LOWER.15(CLR) ADDR_MEM_REG_UPPER.15(CLR) FLAG_REG_LOWER.15(CLR) FLAG_REG_UPPER.15(CLR) INSTRUC_REGISTER_LOWER.15(CLR) INSTRUC_REGISTER_UPPER.15(CLR) OUT_REG_LOWER.15(CLR) OUT_REG_UPPER.15(CLR) R81.1 RAM_ADDR_LOWER.15(CLR) RAM_ADDR_UPPER.15(CLR) REG_A_LOWER.15(CLR) REG_A_UPPER.15(CLR) REG_CALC_LOWER.15(CLR) REG_CALC_UPPER.15(CLR) REG_PARAM_LOWER.15(CLR) REG_PARAM_UPPER.15(CLR) RESET_REGS.4(P1)
COUNTERS_CLEAR: AND_GATE3_.10(C:I1) PROGRAM_COUNTER_LOWER.1 PROGRAM_COUNTER_UPPER.1 R80.1 RESET_PC.1(S)
CTRL_SIG_1: INSTRUCTION_MEMORY_0.11 OUTPUT_BUFFER_INSTRUCTION.2(A1) SELECTOR_INSRUCTION_LOWER.13(4B)
CTRL_SIG_2: INSTRUCTION_MEMORY_0.12 OUTPUT_BUFFER_INSTRUCTION.3(A2) SELECTOR_INSRUCTION_LOWER.10(3B)
CTRL_SIG_3: INSTRUCTION_MEMORY_0.13 OUTPUT_BUFFER_INSTRUCTION.4(A3) SELECTOR_INSRUCTION_LOWER.6(2B)
CTRL_SIG_4: INSTRUCTION_MEMORY_0.15 OUTPUT_BUFFER_INSTRUCTION.5(A4) SELECTOR_INSRUCTION_LOWER.3(1B)
CTRL_SIG_5: INSTRUCTION_MEMORY_0.16 OUTPUT_BUFFER_INSTRUCTION.6(A5) SELECTOR_INSRUCTION_UPPER.13(4B)
CTRL_SIG_6: INSTRUCTION_MEMORY_0.17 OUTPUT_BUFFER_INSTRUCTION.7(A6) SELECTOR_INSRUCTION_UPPER.10(3B)
CTRL_SIG_7: INSTRUCTION_MEMORY_0.18 OUTPUT_BUFFER_INSTRUCTION.8(A7) SELECTOR_INSRUCTION_UPPER.6(2B)
CTRL_SIG_8: INSTRUCTION_MEMORY_0.19 OUTPUT_BUFFER_INSTRUCTION.9(A8) SELECTOR_INSRUCTION_UPPER.3(1B)
CTRL_SIG_9: INSTRUCTION_MEMORY_1.11 SELECTOR_LOGIC_.13(B:B)
CTRL_SIG_10: INSTRUCTION_MEMORY_1.12 SELECTOR_LOGIC_.14(B:A)
CTRL_SIG_11: INSTRUCTION_MEMORY_1.13 NOT_GATE3_.3(B:I)
CTRL_SIG_12: ADDER_LOWER.7(C0) INSTRUCTION_MEMORY_1.15 SUBTRACT_INVRTR_LOWER_.1(A:I0) SUBTRACT_INVRTR_LOWER_.4(B:I0) SUBTRACT_INVRTR_LOWER_.9(C:I0) SUBTRACT_INVRTR_LOWER_.12(D:I0) SUBTRACT_INVRTR_UPPER_.1(A:I0) SUBTRACT_INVRTR_UPPER_.4(B:I0) SUBTRACT_INVRTR_UPPER_.9(C:I0) SUBTRACT_INVRTR_UPPER_.12(D:I0)
CTRL_SIG_13: INSTRUCTION_MEMORY_1.16 NOT_GATE1_.13(F:I)
CTRL_SIG_14: INSTRUCTION_MEMORY_1.17 NOT_GATE4_.11(E:I)
CTRL_SIG_15: INSTRUCTION_MEMORY_1.18 SELECTOR_LOGIC_.2(A:A)
CTRL_SIG_16: INSTRUCTION_MEMORY_1.19 SELECTOR_LOGIC_.3(A:B)
CTRL_SIG_17_(FLAG_OUT): INSTRUCTION_MEMORY_2.11 NOT_GATE_.1(A:I)
CTRL_SIG_18_(STACK_PUSH): INSTRUCTION_MEMORY_2.12 SELECTOR_STACK_.13(B:B)
CTRL_SIG_19_(STACK_POP): INSTRUCTION_MEMORY_2.13 SELECTOR_STACK_.14(B:A)
CTRL_SIG_20_(OUT_REG): INSTRUCTION_MEMORY_2.15 OUT_REG_LOWER.9(G1) OUT_REG_LOWER.10(G2) OUT_REG_UPPER.9(G1) OUT_REG_UPPER.10(G2)
CTRL_SIG_21_(P_REG_IN): NOT_GATE2_.3(B:I) SELECTOR_PARAM_.6(A:Y2)
CTRL_SIG_21_(PARAM_IN): INSTRUCTION_MEMORY_2.16 SELECTOR_PARAM_.3(A:B)
CTRL_SIG_22_(P_REG_OUT): NOT_GATE2_.1(A:I) SELECTOR_PARAM_.5(A:Y1)
CTRL_SIG_22_(PARAM_OUT): INSTRUCTION_MEMORY_2.17 SELECTOR_PARAM_.2(A:A)
CTRL_SIG_23_(LOOP_CONTROL_B): INSTRUCTION_MEMORY_2.18 SELECTOR_BRANCH_.3(A:B)
CTRL_SIG_24_(LOOP_CONTROL_A): INSTRUCTION_MEMORY_2.19 SELECTOR_BRANCH_.2(A:A)
END_CRNT_CMD: AND_GATE3_.9(C:I0) SELECTOR_LOGIC_.9(B:Y3)
END_CRNT_CMD&&BTN_PRESS: AND_GATE3_.8(C:O) MICRO_COUNTER_LOWER.1 MICRO_COUNTER_UPPER.1
GND: 4_INP_OR_GATE.7(P:VSS) ADDR_MEM_REG_LOWER.1(M) ADDR_MEM_REG_LOWER.2(N) ADDR_MEM_REG_UPPER.1(M) ADDR_MEM_REG_UPPER.2(N) AUTO_CLOCK.1(GND) C1.- C2.- C3.- C4.- CLK_TRIGGER.3(P) EXTENSION.11 FLAG_REG_LOWER.1(M) FLAG_REG_LOWER.2(N) FLAG_REG_UPPER.1(M) FLAG_REG_UPPER.2(N) INSTRUC_REGISTER_LOWER.1(M) INSTRUC_REGISTER_LOWER.2(N) INSTRUC_REGISTER_UPPER.1(M) INSTRUC_REGISTER_UPPER.2(N) INSTRUCTION_MEMORY_0.14 INSTRUCTION_MEMORY_0.20 INSTRUCTION_MEMORY_0.22 INSTRUCTION_MEMORY_1.14 INSTRUCTION_MEMORY_1.20 INSTRUCTION_MEMORY_1.22 INSTRUCTION_MEMORY_2.14 INSTRUCTION_MEMORY_2.20 INSTRUCTION_MEMORY_2.22 INSTRUCTIONS_EXTENSION.15 KEYBOARD.4 KEYBOARD_ASCII_TABLE.2 KEYBOARD_ASCII_TABLE.14 KEYBOARD_ASCII_TABLE.20 KEYBOARD_ASCII_TABLE.21 KEYBOARD_ASCII_TABLE.22 KEYBOARD_ASCII_TABLE.23 KEYBOARD_ASCII_TABLE.24 KEYBOARD_ASCII_TABLE.25 KEYBOARD_SHIFT_LOWER.13(G) KEYBOARD_SHIFT_UPPER.13(G) MEMORY.2 MEMORY.14 MEMORY.20 MEMORY.21 MEMORY.22 MEMORY.23 MEMORY.24 MICRO_COUNTER_LOWER.8 MICRO_COUNTER_UPPER.8 OUT_REG_LOWER.1(M) OUT_REG_LOWER.2(N) OUT_REG_UPPER.1(M) OUT_REG_UPPER.2(N) OUT_ROM_LOWER.2 OUT_ROM_LOWER.3 OUT_ROM_LOWER.4 OUT_ROM_LOWER.5 OUT_ROM_LOWER.6 OUT_ROM_LOWER.14 OUT_ROM_LOWER.20 OUT_ROM_LOWER.21 OUT_ROM_LOWER.22 OUT_ROM_LOWER.23 OUT_ROM_LOWER.24 OUT_ROM_LOWER.25 OUT_ROM_UPPER.2 OUT_ROM_UPPER.3 OUT_ROM_UPPER.4 OUT_ROM_UPPER.5 OUT_ROM_UPPER.6 OUT_ROM_UPPER.14 OUT_ROM_UPPER.20 OUT_ROM_UPPER.21 OUT_ROM_UPPER.22 OUT_ROM_UPPER.23 OUT_ROM_UPPER.24 OUT_ROM_UPPER.25 OUT_SEGMENT_LOWER.3(CK1) OUT_SEGMENT_LOWER.8(CK2) OUT_SEGMENT_UPPER.3(CK1) OUT_SEGMENT_UPPER.8(CK2) OUTPUT_BUFFER_ALU.1(DIR) OUTPUT_BUFFER_FLAGS.1(DIR) OUTPUT_BUFFER_KEYBOARD.1(DIR) PROGRAM_COUNTER_LOWER.8 PROGRAM_COUNTER_UPPER.8 R4.1 R5.1 R8.1 R9.1 R10.1 R11.1 R12.1 R13.1 R14.1 R15.1 R16.2 R17.2 R18.2 R19.2 R20.2 R21.2 R22.2 R23.2 R24.2 R25.2 R26.2 R27.2 R28.2 R29.2 R30.2 R31.2 R32.2 R33.2 R34.2 R35.2 R36.2 R37.2 R38.2 R39.2 R40.1 R41.1 R42.1 R43.1 R44.1 R45.1 R53.2 R54.2 R55.2 R56.2 R57.2 R58.2 R59.2 R60.2 R61.2 R62.2 R63.2 R64.2 R65.2 R66.2 R67.2 R68.2 R69.2 R70.2 R71.2 R72.2 R73.2 R74.2 R75.2 R76.2 R77.1 R78.1 R79.1 R81.2 RAM.1 RAM.2 RAM.14 RAM.20 RAM.21 RAM.23 RAM.24 RAM.25 RAM.26 RAM_ADDR_LOWER.1(M) RAM_ADDR_LOWER.2(N) RAM_ADDR_UPPER.1(M) RAM_ADDR_UPPER.2(N) REG_A_LOWER.1(M) REG_A_LOWER.2(N) REG_A_UPPER.1(M) REG_A_UPPER.2(N) REG_CALC_LOWER.1(M) REG_CALC_LOWER.2(N) REG_CALC_UPPER.1(M) REG_CALC_UPPER.2(N) REG_PARAM_LOWER.1(M) REG_PARAM_LOWER.2(N) REG_PARAM_UPPER.1(M) REG_PARAM_UPPER.2(N) RESET_PC.4(P1) SELECTOR_BRANCH_.1(A:G) SELECTOR_BRANCH_.15(B:G) SELECTOR_INSRUCTION_LOWER.2(1A) SELECTOR_INSRUCTION_LOWER.5(2A) SELECTOR_INSRUCTION_LOWER.11(3A) SELECTOR_INSRUCTION_LOWER.14(4A) SELECTOR_INSRUCTION_LOWER.15(G) SELECTOR_INSRUCTION_UPPER.2(1A) SELECTOR_INSRUCTION_UPPER.5(2A) SELECTOR_INSRUCTION_UPPER.11(3A) SELECTOR_INSRUCTION_UPPER.14(4A) SELECTOR_INSRUCTION_UPPER.15(G) SELECTOR_LOGIC_.1(A:G) SELECTOR_LOGIC_.15(B:G) SELECTOR_PARAM_.1(A:G) SELECTOR_PARAM_.15(B:G) SELECTOR_STACK_.1(A:G) SELECTOR_STACK_.15(B:G) STEPPER_CLOCK.1(GND) X1.1 ZERO_POS_FLAG_IDENTIFIER.7(-UB)
HLT_SIGNAL: AND_GATE_.9(C:I0) NOR_GATE_.4(B:O)
INPUT_CTRL: AND_GATE_.13(D:I1) SELECTOR_PARAM_.7(A:Y3) XOR_GATE_2.13(D:I1)
INSTRUCTION_A0: INSTRUC_REGISTER_LOWER.6(Q4) INSTRUCTION_MEMORY_0.10 INSTRUCTION_MEMORY_1.10 INSTRUCTION_MEMORY_2.10 INSTRUCTIONS_EXTENSION.1
INSTRUCTION_A1: INSTRUC_REGISTER_LOWER.5(Q3) INSTRUCTION_MEMORY_0.9 INSTRUCTION_MEMORY_1.9 INSTRUCTION_MEMORY_2.9 INSTRUCTIONS_EXTENSION.2
INSTRUCTION_A2: INSTRUC_REGISTER_LOWER.4(Q2) INSTRUCTION_MEMORY_0.8 INSTRUCTION_MEMORY_1.8 INSTRUCTION_MEMORY_2.8 INSTRUCTIONS_EXTENSION.3
INSTRUCTION_A3: INSTRUC_REGISTER_LOWER.3(Q1) INSTRUCTION_MEMORY_0.7 INSTRUCTION_MEMORY_1.7 INSTRUCTION_MEMORY_2.7 INSTRUCTIONS_EXTENSION.4
INSTRUCTION_A4: INSTRUC_REGISTER_UPPER.6(Q4) INSTRUCTION_MEMORY_0.6 INSTRUCTION_MEMORY_1.6 INSTRUCTION_MEMORY_2.6 INSTRUCTIONS_EXTENSION.5
INSTRUCTION_A5: INSTRUC_REGISTER_UPPER.5(Q3) INSTRUCTION_MEMORY_0.5 INSTRUCTION_MEMORY_1.5 INSTRUCTION_MEMORY_2.5 INSTRUCTIONS_EXTENSION.6
INSTRUCTION_A6: INSTRUC_REGISTER_UPPER.4(Q2) INSTRUCTION_MEMORY_0.4 INSTRUCTION_MEMORY_1.4 INSTRUCTION_MEMORY_2.4 INSTRUCTIONS_EXTENSION.7
INSTRUCTION_A7: INSTRUC_REGISTER_UPPER.3(Q1) INSTRUCTION_MEMORY_0.3 INSTRUCTION_MEMORY_1.3 INSTRUCTION_MEMORY_2.3 INSTRUCTIONS_EXTENSION.8
INSTRUCTION_IN: INSTRUC_REGISTER_LOWER.9(G1) INSTRUC_REGISTER_LOWER.10(G2) INSTRUC_REGISTER_UPPER.9(G1) INSTRUC_REGISTER_UPPER.10(G2) SELECTOR_LOGIC_.5(A:Y1)
INSTRUCTION_OUTPUT: OUTPUT_BUFFER_INSTRUCTION.19(G) SELECTOR_INSRUCTION_LOWER.1(!A!/B) SELECTOR_INSRUCTION_UPPER.1(!A!/B) SELECTOR_LOGIC_.6(A:Y2)
INV_FLAG_TOGGLE_IN: FLAG_REG_LOWER.9(G1) FLAG_REG_LOWER.10(G2) FLAG_REG_UPPER.9(G1) FLAG_REG_UPPER.10(G2) NOT_GATE1_.12(F:O)
INVERTED_CLOCK: INVERTED_CLK_LED.A MICRO_COUNTER_LOWER.2 MICRO_COUNTER_UPPER.2 NOT_GATE1_.10(E:O)
MEMORY_IN: NOT_GATE1_.5(C:I) SELECTOR_PARAM_.10(B:Y2)
MEMORY_OUT: NOT_GATE1_.9(D:I) SELECTOR_PARAM_.11(B:Y1)
MICRO_A8: INSTRUCTION_MEMORY_0.25 INSTRUCTION_MEMORY_1.25 INSTRUCTION_MEMORY_2.25 INSTRUCTIONS_EXTENSION.9 MICRO_COUNTER_LOWER.14 USTEP_1.A
MICRO_A9: INSTRUCTION_MEMORY_0.24 INSTRUCTION_MEMORY_1.24 INSTRUCTION_MEMORY_2.24 INSTRUCTIONS_EXTENSION.10 MICRO_COUNTER_LOWER.13 USTEP_2.A
MICRO_A10: INSTRUCTION_MEMORY_0.21 INSTRUCTION_MEMORY_1.21 INSTRUCTION_MEMORY_2.21 INSTRUCTIONS_EXTENSION.11 MICRO_COUNTER_LOWER.12 USTEP_4.A
MICRO_A11: INSTRUCTION_MEMORY_0.23 INSTRUCTION_MEMORY_1.23 INSTRUCTION_MEMORY_2.23 INSTRUCTIONS_EXTENSION.12 MICRO_COUNTER_LOWER.11 USTEP_3.A
MICRO_A12: INSTRUCTION_MEMORY_0.2 INSTRUCTION_MEMORY_1.2 INSTRUCTION_MEMORY_2.2 INSTRUCTIONS_EXTENSION.13 MICRO_COUNTER_UPPER.14 USTEP_5.A
MODE_SIGNAL: AND_GATE_.4(B:I0) CLK_MODE.1 NOT_GATE1_.3(B:I) R4.2
N$1: C2.+ R3.1 STEPPER_CLOCK.6(THR) STEPPER_CLOCK.7(DIS)
N$2: CLK_TRIGGER.2(S1) R2.2 STEPPER_CLOCK.2(TR)
N$3: CLOCK.K(C) R5.2
N$4: AND_GATE_.5(B:I1) STEPPER_CLOCK.3(Q)
N$5: SELECTOR_INSRUCTION_LOWER.12(4Y) SELECTOR_PARAM_.13(B:B)
N$6: AND_GATE_.1(A:I0) AUTO_CLOCK.3(Q)
N$7: PARAM_LED_3.K(C) R69.1
N$8: NOT_GATE3_.4(B:O) OUTPUT_BUFFER_ALU.19(G)
N$9: AND_GATE_.2(A:I1) NOT_GATE1_.4(B:O)
N$10: SELECTOR_INSRUCTION_LOWER.9(3Y) SELECTOR_PARAM_.14(B:A)
N$11: AND_GATE_.10(C:I1) OR_GATE_.3(A:O)
N$12: PARAM_LED_2.K(C) R70.1
N$13: AND_GATE_.3(A:O) OR_GATE_.1(A:I0)
N$14: AND_GATE_.6(B:O) OR_GATE_.2(A:I1)
N$15: PARAM_LED_1.K(C) R71.1
N$16: AUTO_CLOCK.2(TR) AUTO_CLOCK.6(THR) C1.+ R7.2
N$17: PARAM_LED_5.K(C) R72.1
N$18: FLAG_6.A FLAG_REG_LOWER.5(Q3) OUTPUT_BUFFER_FLAGS.13(B6) XOR_GATE_2.4(B:I0)
N$19: ADDER_LOWER.6(B1) SUBTRACT_INVRTR_LOWER_.11(D:O)
N$20: ADDER_LOWER.2(B2) SUBTRACT_INVRTR_LOWER_.8(C:O)
N$21: ADDER_LOWER.15(B3) SUBTRACT_INVRTR_LOWER_.6(B:O)
N$22: ADDER_LOWER.11(B4) SUBTRACT_INVRTR_LOWER_.3(A:O)
N$23: ADDER_UPPER.6(B1) SUBTRACT_INVRTR_UPPER_.11(D:O)
N$24: ADDER_UPPER.2(B2) SUBTRACT_INVRTR_UPPER_.8(C:O)
N$25: ADDER_UPPER.15(B3) SUBTRACT_INVRTR_UPPER_.6(B:O)
N$26 [Databus]: KEYBOARD_ASCII_TABLE.17 OUTPUT_BUFFER_KEYBOARD.13(B6)
N$27: ADDER_UPPER.11(B4) SUBTRACT_INVRTR_UPPER_.3(A:O)
N$28: OUTPUT_BUFFER_RAM.3(A2) RAM.12 RAM_LED_2.A
N$29: OUTPUT_BUFFER_RAM.4(A3) RAM.13 RAM_LED_3.A
N$30: OUTPUT_BUFFER_RAM.5(A4) RAM.15 RAM_LED_4.A
N$31: OUTPUT_BUFFER_RAM.6(A5) RAM.16 RAM_LED_5.A
N$32: OUTPUT_BUFFER_RAM.7(A6) RAM.17 RAM_LED_6.A
N$33: OUTPUT_BUFFER_RAM.8(A7) RAM.18 RAM_LED_7.A
N$34: OUTPUT_BUFFER_RAM.9(A8) RAM.19 RAM_LED_8.A
N$35: R33.1 RAM_LED_2.K(C)
N$36: AND_GATE4_.1(A:I0) NOT_GATE2_.6(C:O)
N$37: NOT_GATE2_.12(F:O) RAM.27
N$38: R34.1 RAM_LED_3.K(C)
N$39: R35.1 RAM_LED_4.K(C)
N$41: FLAG_8.A FLAG_REG_LOWER.3(Q1) OUTPUT_BUFFER_FLAGS.11(B8)
N$42: FLAG_7.A FLAG_REG_LOWER.4(Q2) OUTPUT_BUFFER_FLAGS.12(B7) XOR_GATE_2.9(C:I0)
N$43: SELECTOR_BRANCH_.14(B:A) SELECTOR_INSRUCTION_LOWER.4(1Y)
N$44: FLAG_5.A FLAG_REG_LOWER.6(Q4) OUTPUT_BUFFER_FLAGS.14(B5) XOR_GATE_2.1(A:I0)
N$45: AND_GATE3_.12(D:I0) NOT_GATE2_.8(D:O)
N$46: R36.1 RAM_LED_5.K(C)
N$47: R37.1 RAM_LED_6.K(C)
N$48: SELECTOR_BRANCH_.13(B:B) SELECTOR_INSRUCTION_LOWER.7(2Y)
N$49: R38.1 RAM_LED_7.K(C)
N$50: R39.1 RAM_LED_8.K(C)
N$51: FREQUENCY.S R7.1
N$52: R32.1 RAM_LED_1.K(C)
N$53: AND_GATE4_.4(B:I0) NOT_GATE1_.2(A:O)
N$54: FLAG_2.A FLAG_REG_UPPER.5(Q3) OUTPUT_BUFFER_FLAGS.17(B2) XOR_GATE_1.4(B:I0)
N$55: SELECTOR_INSRUCTION_UPPER.9(3Y) SELECTOR_STACK_.2(A:A)
N$57: NOT_GATE4_.4(B:O) RAM_ADDR_LOWER.9(G1) RAM_ADDR_LOWER.10(G2) RAM_ADDR_UPPER.9(G1) RAM_ADDR_UPPER.10(G2)
N$58: FLAG_REG_LOWER.13(D2) XOR_GATE_2.8(C:O)
N$59: FLAG_REG_LOWER.12(D3) XOR_GATE_2.6(B:O)
N$60: FLAG_REG_LOWER.11(D4) XOR_GATE_2.3(A:O)
N$61: KEYBOARD.2 KEYBOARD_SHIFT_UPPER.14(SER)
N$62: MICRO_COUNTER_LOWER.15 MICRO_COUNTER_UPPER.10
N$63: D1.A KEYBOARD_SHIFT_LOWER.11(SCK) KEYBOARD_SHIFT_UPPER.11(SCK) NOT_GATE3_.2(A:O) NOT_GATE3_.5(C:I) R6.1
N$64: FLAG_8.K(C) R8.2
N$65: R14.2 ZERO_FLAG.K(C)
N$66: OVERFLOW_FLAG.K(C) R13.2
N$67: POSITIVE_FLAG.K(C) R12.2
N$68: FLAG_5.K(C) R11.2
N$69: FLAG_6.K(C) R10.2
N$70: FLAG_7.K(C) R9.2
N$71: FLAG_3.A FLAG_REG_UPPER.4(Q2) OUTPUT_BUFFER_FLAGS.16(B3) XOR_GATE_1.9(C:I0)
N$72: FLAG_1.K(C) R15.2
N$73: OUTPUT_BUFFER_RAM.2(A1) RAM.11 RAM_LED_1.A
N$74: KEYBOARD.3 NOT_GATE3_.1(A:I)
N$75: KEYBOARD_SHIFT_LOWER.12(RCK) KEYBOARD_SHIFT_UPPER.12(RCK) NOT_GATE3_.6(C:O)
N$76: 4_INP_OR_GATE.3(A:I1) AND_GATE3_.11(D:O)
N$77: 4_INP_OR_GATE.4(A:I2) AND_GATE4_.3(A:O)
N$78: AUTO_CLOCK.7(DIS) FREQUENCY.E R1.2
N$79: 4_INP_OR_GATE.5(A:I3) AND_GATE4_.6(B:O)
N$80: KEYBOARD_ASCII_TABLE.3 KEYBOARD_SHIFT_UPPER.2(QC)
N$81: KEYBOARD_SHIFT_LOWER.14(SER) KEYBOARD_SHIFT_UPPER.9(QH*)
N$82: KEYBOARD_ASCII_TABLE.4 KEYBOARD_SHIFT_UPPER.3(QD)
N$83: NOT_GATE_.2(A:O) OUTPUT_BUFFER_FLAGS.19(G)
N$84: KEYBOARD_ASCII_TABLE.5 KEYBOARD_SHIFT_UPPER.4(QE)
N$85: KEYBOARD_ASCII_TABLE.6 KEYBOARD_SHIFT_UPPER.5(QF)
N$86: KEYBOARD_ASCII_TABLE.7 KEYBOARD_SHIFT_UPPER.6(QG)
N$87: RAM.3 RAM_ADDR_UPPER.6(Q4)
N$88: RAM.10 RAM_ADDR_LOWER.3(Q1)
N$89: RAM.9 RAM_ADDR_LOWER.4(Q2)
N$90: RAM.8 RAM_ADDR_LOWER.5(Q3)
N$91: RAM.7 RAM_ADDR_LOWER.6(Q4)
N$92: RAM.6 RAM_ADDR_UPPER.3(Q1)
N$93: RAM.5 RAM_ADDR_UPPER.4(Q2)
N$94: RAM.4 RAM_ADDR_UPPER.5(Q3)
N$95: KEYBOARD_ASCII_TABLE.8 KEYBOARD_SHIFT_UPPER.7(QH)
N$96: KEYBOARD_ASCII_TABLE.9 KEYBOARD_SHIFT_LOWER.15(QA)
N$97: KEYBOARD_ASCII_TABLE.10 KEYBOARD_SHIFT_LOWER.1(QB)
N$98: NOT_GATE3_.8(D:O) NOT_GATE3_.11(E:I)
N$99: NOT_GATE3_.9(D:I) NOT_GATE_.4(B:O)
N$100: NOR_GATE_.2(A:I0) NOT_GATE_.6(C:O)
N$101 [Databus]: KEYBOARD_ASCII_TABLE.19 OUTPUT_BUFFER_KEYBOARD.11(B8)
N$102 [Databus]: KEYBOARD_ASCII_TABLE.16 OUTPUT_BUFFER_KEYBOARD.14(B5)
N$103 [Databus]: KEYBOARD_ASCII_TABLE.18 OUTPUT_BUFFER_KEYBOARD.12(B7)
N$104 [Databus]: KEYBOARD_ASCII_TABLE.11 OUTPUT_BUFFER_KEYBOARD.18(B1)
N$105 [Databus]: KEYBOARD_ASCII_TABLE.13 OUTPUT_BUFFER_KEYBOARD.16(B3)
N$106: C4.+ D1.C NOR_GATE_.3(A:I1) NOT_GATE_.3(B:I) R6.2
N$107: 4_INP_OR_GATE.1(A:O) AND_GATE3_.1(A:I0) AND_GATE3_.4(B:I0)
N$108: NOT_GATE3_.10(E:O) NOT_GATE3_.13(F:I)
N$109: NOT_GATE3_.12(F:O) NOT_GATE_.5(C:I)
N$110 [Databus]: KEYBOARD_ASCII_TABLE.12 OUTPUT_BUFFER_KEYBOARD.17(B2)
N$111: NOT_GATE2_.4(B:O) REG_PARAM_LOWER.9(G1) REG_PARAM_LOWER.10(G2) REG_PARAM_UPPER.9(G1) REG_PARAM_UPPER.10(G2)
N$112: NOT_GATE2_.2(A:O) OUTPUT_BUFFER_PARAM_REG.19(G)
N$113: AND_GATE_.11(D:O) XOR_GATE_2.12(D:I0)
N$114: R40.2 USTEP_1.K(C)
N$115: R41.2 USTEP_2.K(C)
N$116: R42.2 USTEP_3.K(C)
N$117: R43.2 USTEP_4.K(C)
N$118: R44.2 USTEP_5.K(C)
N$119: LED_A_REG_1.K(C) R53.1
N$120: LED_A_REG_2.K(C) R54.1
N$121: LED_A_REG_3.K(C) R55.1
N$122: LED_A_REG_4.K(C) R56.1
N$123: LED_A_REG_5.K(C) R57.1
N$124: LED_A_REG_6.K(C) R58.1
N$125: NOR_GATE_.5(B:I0) SELECTOR_LOGIC_.7(A:Y3)
N$126: AND_GATE_.12(D:I0) NOR_GATE_.1(A:O)
N$127: NOR_GATE_.6(B:I1) XOR_GATE_2.11(D:O)
N$128 [Databus]: KEYBOARD_ASCII_TABLE.15 OUTPUT_BUFFER_KEYBOARD.15(B4)
N$129: OUT_ROM_UPPER.11 OUT_SEGMENT_UPPER.4(C)
N$130: OUT_ROM_UPPER.12 OUT_SEGMENT_UPPER.2(D)
N$131: DATABUS_1.K(C) R24.1
N$132: INVERTED_CLK_LED.K(C) R45.2
N$133: DATABUS_2.K(C) R25.1
N$134: DATABUS_3.K(C) R26.1
N$135: DATABUS_4.K(C) R27.1
N$136: DATABUS_5.K(C) R28.1
N$137: DATABUS_6.K(C) R29.1
N$138: DATABUS_7.K(C) R30.1
N$139: OUT_ROM_UPPER.13 OUT_SEGMENT_UPPER.1(E)
N$140: DATABUS_8.K(C) R31.1
N$141: OUT_REG_UPPER.3(Q1) OUT_ROM_UPPER.7
N$142: OUT_REG_UPPER.4(Q2) OUT_ROM_UPPER.8
N$143: OUT_REG_UPPER.5(Q3) OUT_ROM_UPPER.9
N$144: OUT_REG_UPPER.6(Q4) OUT_ROM_UPPER.10
N$145: OUT_REG_LOWER.6(Q4) OUT_ROM_LOWER.10
N$146: OUT_REG_LOWER.5(Q3) OUT_ROM_LOWER.9
N$147: OUT_REG_LOWER.4(Q2) OUT_ROM_LOWER.8
N$148: OUT_REG_LOWER.3(Q1) OUT_ROM_LOWER.7
N$149: ADDR_MEM_REG_LOWER.6(Q4) MEMORY.10
N$150: ADDR_MEM_REG_LOWER.5(Q3) MEMORY.9
N$151: ADDR_MEM_REG_LOWER.4(Q2) MEMORY.8
N$152: ADDR_MEM_REG_LOWER.3(Q1) MEMORY.7
N$153: ADDR_MEM_REG_UPPER.6(Q4) MEMORY.6
N$154: ADDR_MEM_REG_UPPER.5(Q3) MEMORY.5
N$155: ADDR_MEM_REG_UPPER.4(Q2) MEMORY.4
N$156: ADDR_MEM_REG_UPPER.3(Q1) MEMORY.3
N$157: MEMORY.13 OUTPUT_BUFFER_MEMORY.7(A6)
N$158: MEMORY.12 OUTPUT_BUFFER_MEMORY.8(A7)
N$159: MEMORY.11 OUTPUT_BUFFER_MEMORY.9(A8)
N$160: MEMORY.15 OUTPUT_BUFFER_MEMORY.6(A5)
N$161: MEMORY.16 OUTPUT_BUFFER_MEMORY.5(A4)
N$162: MEMORY.17 OUTPUT_BUFFER_MEMORY.4(A3)
N$163: MEMORY.18 OUTPUT_BUFFER_MEMORY.3(A2)
N$164: MEMORY.19 OUTPUT_BUFFER_MEMORY.2(A1)
N$165: OUT_ROM_LOWER.13 OUT_SEGMENT_LOWER.4(C)
N$166: OUT_ROM_LOWER.12 OUT_SEGMENT_LOWER.2(D)
N$167: OUT_ROM_LOWER.11 OUT_SEGMENT_LOWER.1(E)
N$168: OUT_ROM_LOWER.15 OUT_SEGMENT_LOWER.6(B)
N$169: LED_A_REG_7.K(C) R59.1
N$170: PROGRAM_COUNTER_LOWER.15 PROGRAM_COUNTER_UPPER.10
N$171: OUTPUT_BUFFER_PC.9(A8) PC_1.A PROGRAM_COUNTER_LOWER.14
N$172: OUTPUT_BUFFER_PC.8(A7) PC_2.A PROGRAM_COUNTER_LOWER.13
N$173: OUTPUT_BUFFER_PC.7(A6) PC_3.A PROGRAM_COUNTER_LOWER.12
N$174: OUTPUT_BUFFER_PC.6(A5) PC_4.A PROGRAM_COUNTER_LOWER.11
N$175: OUTPUT_BUFFER_PC.4(A3) PC_6.A PROGRAM_COUNTER_UPPER.13
N$176: LED_A_REG_8.K(C) R60.1
N$177: PC_1.K(C) R16.1
N$178: PC_2.K(C) R17.1
N$179: PC_3.K(C) R18.1
N$180: PC_4.K(C) R19.1
N$181: PC_5.K(C) R20.1
N$182: PC_6.K(C) R21.1
N$183: PC_7.K(C) R22.1
N$184: PC_8.K(C) R23.1
N$185: LED_B_REG_1.K(C) R61.1
N$186: LED_B_REG_2.K(C) R62.1
N$187: LED_B_REG_3.K(C) R63.1
N$188: LED_B_REG_4.K(C) R64.1
N$189: LED_B_REG_5.K(C) R65.1
N$190: OUT_ROM_LOWER.16 OUT_SEGMENT_LOWER.7(A)
N$191: LED_B_REG_6.K(C) R66.1
N$192: OUT_ROM_LOWER.17 OUT_SEGMENT_LOWER.9(F)
N$193: OUT_ROM_LOWER.18 OUT_SEGMENT_LOWER.10(G)
N$194: OUTPUT_BUFFER_PC.3(A2) PC_7.A PROGRAM_COUNTER_UPPER.12
N$195: OUTPUT_BUFFER_PC.5(A4) PC_5.A PROGRAM_COUNTER_UPPER.14
N$196: OUTPUT_BUFFER_PC.2(A1) PC_8.A PROGRAM_COUNTER_UPPER.11
N$197: OUT_ROM_LOWER.19 OUT_SEGMENT_LOWER.5(DP)
N$198: OUT_ROM_UPPER.16 OUT_SEGMENT_UPPER.7(A)
N$199: OUT_ROM_UPPER.15 OUT_SEGMENT_UPPER.6(B)
N$200: OUT_ROM_UPPER.19 OUT_SEGMENT_UPPER.9(F)
N$201: OUT_ROM_UPPER.18 OUT_SEGMENT_UPPER.10(G)
N$202: LED_B_REG_7.K(C) R67.1
N$203: LED_B_REG_8.K(C) R68.1
N$204: PARAM_LED_6.K(C) R73.1
N$205: PARAM_LED_7.K(C) R74.1
N$206: PARAM_LED_8.K(C) R75.1
N$207: PARAM_LED_4.K(C) R76.1
N$208: OUT_ROM_UPPER.17 OUT_SEGMENT_UPPER.5(DP)
N$209: 4_INP_OR_GATE.2(A:I0) NOT_GATE4_.2(A:O)
N$210: OUTPUT_BUFFER_KEYBOARD.19(G) SELECTOR_PARAM_.9(B:Y3)
N$212: SELECTOR_INSRUCTION_UPPER.12(4Y) SELECTOR_STACK_.3(A:B)
N$217: FLAG_4.A FLAG_REG_UPPER.3(Q1) OUTPUT_BUFFER_FLAGS.15(B4) XOR_GATE_1.12(D:I0)
N$219: FLAG_REG_UPPER.11(D4) XOR_GATE_1.3(A:O)
N$220: FLAG_REG_UPPER.12(D3) XOR_GATE_1.6(B:O)
N$221: FLAG_REG_UPPER.13(D2) XOR_GATE_1.8(C:O)
N$222: FLAG_REG_UPPER.14(D1) XOR_GATE_1.11(D:O)
N$223: NOT_GATE4_.10(E:O) OUTPUT_BUFFER_RAM.19(G)
N$225: AND_GATE3_.5(B:I1) NOT_GATE4_.12(F:O)
N$226: AND_GATE3_.2(A:I1) NOT_GATE_.8(D:O)
N$227: FLAG_2.K(C) R77.2
N$228: FLAG_3.K(C) R78.2
N$229: FLAG_4.K(C) R79.2
OF_SELECTED: NOT_GATE2_.9(D:I) SELECTOR_BRANCH_.5(A:Y1)
OVERFLOW_FLAG: ADDER_UPPER.9(C4) AND_GATE3_.13(D:I1) FLAG_REG_LOWER.14(D1) OVERFLOW_FLAG.A
PC_INC: NOT_GATE2_.11(E:I) SELECTOR_STACK_.7(A:Y3)
PC_LOAD: AND_GATE3_.3(A:O) NOT_GATE4_.5(C:I)
PC_LOAD_SIGNAL: NOT_GATE_.9(D:I) SELECTOR_STACK_.5(A:Y1)
PC_OUT: OUTPUT_BUFFER_PC.19(G) SELECTOR_STACK_.6(A:Y2)
PF_SELECTED: NOT_GATE1_.1(A:I) SELECTOR_BRANCH_.7(A:Y3)
RAM_ADDR_IN: NOT_GATE4_.3(B:I) SELECTOR_INSRUCTION_UPPER.4(1Y)
RAM_WRITE: NOT_GATE2_.13(F:I) RAM.22 SELECTOR_INSRUCTION_UPPER.7(2Y)
RAW_INP_MODE: OUTPUT_BUFFER_RAM.1(DIR) SELECTOR_STACK_.9(B:Y3)
REG_A_1PLACE: ADDER_LOWER.5(A1) LED_A_REG_1.A OUTPUT_BUFFER_REG_A.9(A8) REG_A_LOWER.6(Q4) ZERO_POS_FLAG_IDENTIFIER.5(D)
REG_A_2PLACE: ADDER_LOWER.3(A2) LED_A_REG_2.A OUTPUT_BUFFER_REG_A.8(A7) REG_A_LOWER.5(Q3) ZERO_POS_FLAG_IDENTIFIER.4(C)
REG_A_4PLACE: ADDER_LOWER.14(A3) LED_A_REG_3.A OUTPUT_BUFFER_REG_A.7(A6) REG_A_LOWER.4(Q2) ZERO_POS_FLAG_IDENTIFIER.3(B)
REG_A_8PLACE: ADDER_LOWER.12(A4) LED_A_REG_4.A OUTPUT_BUFFER_REG_A.6(A5) REG_A_LOWER.3(Q1) ZERO_POS_FLAG_IDENTIFIER.2(A)
REG_A_16PLACE: ADDER_UPPER.5(A1) LED_A_REG_5.A OUTPUT_BUFFER_REG_A.5(A4) REG_A_UPPER.6(Q4) ZERO_POS_FLAG_IDENTIFIER.9(E)
REG_A_32PLACE: ADDER_UPPER.3(A2) LED_A_REG_6.A OUTPUT_BUFFER_REG_A.4(A3) REG_A_UPPER.5(Q3) ZERO_POS_FLAG_IDENTIFIER.10(F)
REG_A_64PLACE: ADDER_UPPER.14(A3) LED_A_REG_7.A OUTPUT_BUFFER_REG_A.3(A2) REG_A_UPPER.4(Q2) ZERO_POS_FLAG_IDENTIFIER.11(G)
REG_A_128PLACE: ADDER_UPPER.12(A4) LED_A_REG_8.A OUTPUT_BUFFER_REG_A.2(A1) REG_A_UPPER.3(Q1) ZERO_POS_FLAG_IDENTIFIER.12(H)
REG_A_IN: REG_A_LOWER.9(G1) REG_A_LOWER.10(G2) REG_A_UPPER.9(G1) REG_A_UPPER.10(G2) SELECTOR_BRANCH_.10(B:Y2)
REG_A_OUT: OUTPUT_BUFFER_REG_A.19(G) SELECTOR_BRANCH_.11(B:Y1)
REG_B_1PLACE: LED_B_REG_1.A OUTPUT_BUFFER_CALC_REG.9(A8) REG_CALC_LOWER.6(Q4) SUBTRACT_INVRTR_LOWER_.13(D:I1)
REG_B_2PLACE: LED_B_REG_2.A OUTPUT_BUFFER_CALC_REG.8(A7) REG_CALC_LOWER.5(Q3) SUBTRACT_INVRTR_LOWER_.10(C:I1)
REG_B_4PLACE: LED_B_REG_3.A OUTPUT_BUFFER_CALC_REG.7(A6) REG_CALC_LOWER.4(Q2) SUBTRACT_INVRTR_LOWER_.5(B:I1)
REG_B_8PLACE: LED_B_REG_4.A OUTPUT_BUFFER_CALC_REG.6(A5) REG_CALC_LOWER.3(Q1) SUBTRACT_INVRTR_LOWER_.2(A:I1)
REG_B_16PLACE: LED_B_REG_5.A OUTPUT_BUFFER_CALC_REG.5(A4) REG_CALC_UPPER.6(Q4) SUBTRACT_INVRTR_UPPER_.13(D:I1)
REG_B_32PLACE: LED_B_REG_6.A OUTPUT_BUFFER_CALC_REG.4(A3) REG_CALC_UPPER.5(Q3) SUBTRACT_INVRTR_UPPER_.10(C:I1)
REG_B_64PLACE: LED_B_REG_7.A OUTPUT_BUFFER_CALC_REG.3(A2) REG_CALC_UPPER.4(Q2) SUBTRACT_INVRTR_UPPER_.5(B:I1)
REG_B_128PLACE: LED_B_REG_8.A OUTPUT_BUFFER_CALC_REG.2(A1) REG_CALC_UPPER.3(Q1) SUBTRACT_INVRTR_UPPER_.2(A:I1)
REG_P_1PLACE: OUTPUT_BUFFER_PARAM_REG.9(A8) PARAM_LED_1.A REG_PARAM_LOWER.6(Q4)
REG_P_2PLACE: OUTPUT_BUFFER_PARAM_REG.8(A7) PARAM_LED_2.A REG_PARAM_LOWER.5(Q3)
REG_P_4PLACE: OUTPUT_BUFFER_PARAM_REG.7(A6) PARAM_LED_3.A REG_PARAM_LOWER.4(Q2)
REG_P_8PLACE: OUTPUT_BUFFER_PARAM_REG.6(A5) PARAM_LED_4.A REG_PARAM_LOWER.3(Q1)
REG_P_16PLACE: OUTPUT_BUFFER_PARAM_REG.5(A4) PARAM_LED_5.A REG_PARAM_UPPER.6(Q4)
REG_P_32PLACE: OUTPUT_BUFFER_PARAM_REG.4(A3) PARAM_LED_6.A REG_PARAM_UPPER.5(Q3)
REG_P_64PLACE: OUTPUT_BUFFER_PARAM_REG.3(A2) PARAM_LED_7.A REG_PARAM_UPPER.4(Q2)
REG_P_128PLACE: OUTPUT_BUFFER_PARAM_REG.2(A1) PARAM_LED_8.A REG_PARAM_UPPER.3(Q1)
STACK_POP: SELECTOR_STACK_.11(B:Y1)
STACK_PUSH: SELECTOR_STACK_.10(B:Y2)
SUB_COUNTER_LOAD: AND_GATE3_.6(B:O) NOT_GATE4_.9(D:I)
SUB_LOAD_SIGNAL: NOT_GATE4_.13(F:I) SELECTOR_BRANCH_.9(B:Y3)
SUM_1: ADDER_LOWER.4(S1) OUTPUT_BUFFER_ALU.18(B1)
SUM_2: ADDER_LOWER.1(S2) OUTPUT_BUFFER_ALU.17(B2)
SUM_4: ADDER_LOWER.13(S3) OUTPUT_BUFFER_ALU.16(B3)
SUM_8: ADDER_LOWER.10(S4) OUTPUT_BUFFER_ALU.15(B4)
SUM_16: ADDER_UPPER.4(S1) OUTPUT_BUFFER_ALU.14(B5)
SUM_32: ADDER_UPPER.1(S2) OUTPUT_BUFFER_ALU.13(B6)
SUM_64: ADDER_UPPER.13(S3) OUTPUT_BUFFER_ALU.12(B7)
SUM_128: ADDER_UPPER.10(S4) OUTPUT_BUFFER_ALU.11(B8)
SUM_CARRY: ADDER_LOWER.9(C4) ADDER_UPPER.7(C0)
UNCONDITIONAL_SELECTED: NOT_GATE4_.1(A:I) SELECTOR_BRANCH_.4(A:Y0)
VCC: 4_INP_OR_GATE.14(P:VDD) AUTO_CLOCK.4(R) AUTO_CLOCK.8(V+) C3.+ CLK_MODE.2 EXTENSION.10 INSTRUCTION_MEMORY_0.27 INSTRUCTION_MEMORY_0.28 INSTRUCTION_MEMORY_1.27 INSTRUCTION_MEMORY_1.28 INSTRUCTION_MEMORY_2.27 INSTRUCTION_MEMORY_2.28 INSTRUCTIONS_EXTENSION.14 KEYBOARD.1 KEYBOARD_ASCII_TABLE.27 KEYBOARD_ASCII_TABLE.28 KEYBOARD_SHIFT_LOWER.10(SCL) KEYBOARD_SHIFT_UPPER.10(SCL) MEMORY.27 MEMORY.28 MICRO_COUNTER_LOWER.7 MICRO_COUNTER_LOWER.10 MICRO_COUNTER_LOWER.16 MICRO_COUNTER_UPPER.7 MICRO_COUNTER_UPPER.16 OUT_ROM_LOWER.27 OUT_ROM_LOWER.28 OUT_ROM_UPPER.27 OUT_ROM_UPPER.28 OUTPUT_BUFFER_CALC_REG.1(DIR) OUTPUT_BUFFER_INSTRUCTION.1(DIR) OUTPUT_BUFFER_MEMORY.1(DIR) OUTPUT_BUFFER_PARAM_REG.1(DIR) OUTPUT_BUFFER_PC.1(DIR) OUTPUT_BUFFER_REG_A.1(DIR) PROGRAM_COUNTER_LOWER.7 PROGRAM_COUNTER_LOWER.16 PROGRAM_COUNTER_UPPER.7 PROGRAM_COUNTER_UPPER.16 R1.1 R2.1 R3.2 R80.2 RAM.28 RESET_REGS.1(S) STEPPER_CLOCK.8(V+) X1.2 ZERO_POS_FLAG_IDENTIFIER.14(+UB)
ZERO_FLAG: AND_GATE4_.2(A:I1) ZERO_FLAG.A ZERO_POS_FLAG_IDENTIFIER.13(W)
ZF_SELECTED: NOT_GATE2_.5(C:I) SELECTOR_BRANCH_.6(A:Y2)
~DATA/PARAM: FLAG_1.A FLAG_REG_UPPER.6(Q4) MEMORY.25 OUTPUT_BUFFER_FLAGS.18(B1) XOR_GATE_1.1(A:I0)
~MEMORY_IN: ADDR_MEM_REG_LOWER.9(G1) ADDR_MEM_REG_LOWER.10(G2) ADDR_MEM_REG_UPPER.9(G1) ADDR_MEM_REG_UPPER.10(G2) NOT_GATE1_.6(C:O)
~MEMORY_OUT: NOT_GATE1_.8(D:O) OUTPUT_BUFFER_MEMORY.19(G)
~PC_INC: NOT_GATE2_.10(E:O) PROGRAM_COUNTER_LOWER.10
~PC_LOAD: NOT_GATE4_.6(C:O) PROGRAM_COUNTER_LOWER.9 PROGRAM_COUNTER_UPPER.9
~SUB_COUNTER_LOAD: MICRO_COUNTER_LOWER.9 MICRO_COUNTER_UPPER.9 NOT_GATE4_.8(D:O)
Unconnected: 4_INP_OR_GATE.9(B:I0) 4_INP_OR_GATE.10(B:I1) 4_INP_OR_GATE.11(B:I2) 4_INP_OR_GATE.12(B:I3) 4_INP_OR_GATE.13(B:O) AND_GATE4_.8(C:O) AND_GATE4_.9(C:I0) AND_GATE4_.10(C:I1) AND_GATE4_.11(D:O) AND_GATE4_.12(D:I0) AND_GATE4_.13(D:I1) AUTO_CLOCK.5(CV) CLK_TRIGGER.1(S) CLK_TRIGGER.4(P1) FREQUENCY.A IC1.1(!CLEAR) IC1.2(CLK) IC1.3(P1) IC1.4(P2) IC1.5(P3) IC1.6(P4) IC1.7(PE) IC1.9(!LOAD) IC1.10(TE) IC1.11(Q4) IC1.12(Q3) IC1.13(Q2) IC1.14(Q1) IC1.15(CO) INSTRUCTION_MEMORY_0.1 INSTRUCTION_MEMORY_0.26 INSTRUCTION_MEMORY_1.1 INSTRUCTION_MEMORY_1.26 INSTRUCTION_MEMORY_2.1 INSTRUCTION_MEMORY_2.26 KEYBOARD_ASCII_TABLE.1 KEYBOARD_ASCII_TABLE.26 KEYBOARD_SHIFT_LOWER.2(QC) KEYBOARD_SHIFT_LOWER.3(QD) KEYBOARD_SHIFT_LOWER.4(QE) KEYBOARD_SHIFT_LOWER.5(QF) KEYBOARD_SHIFT_LOWER.6(QG) KEYBOARD_SHIFT_LOWER.7(QH) KEYBOARD_SHIFT_LOWER.9(QH*) KEYBOARD_SHIFT_UPPER.1(QB) KEYBOARD_SHIFT_UPPER.15(QA) MEMORY.1 MEMORY.26 MICRO_COUNTER_UPPER.4 MICRO_COUNTER_UPPER.5 MICRO_COUNTER_UPPER.6 MICRO_COUNTER_UPPER.11 MICRO_COUNTER_UPPER.12 MICRO_COUNTER_UPPER.13 MICRO_COUNTER_UPPER.15 NOR_GATE_.8(C:I0) NOR_GATE_.9(C:I1) NOR_GATE_.10(C:O) NOR_GATE_.11(D:I0) NOR_GATE_.12(D:I1) NOR_GATE_.13(D:O) NOT_GATE_.10(E:O) NOT_GATE_.11(E:I) NOT_GATE_.12(F:O) NOT_GATE_.13(F:I) OR_GATE_.4(B:I0) OR_GATE_.5(B:I1) OR_GATE_.6(B:O) OR_GATE_.8(C:O) OR_GATE_.9(C:I0) OR_GATE_.10(C:I1) OR_GATE_.11(D:O) OR_GATE_.12(D:I0) OR_GATE_.13(D:I1) OUT_ROM_LOWER.1 OUT_ROM_LOWER.26 OUT_ROM_UPPER.1 OUT_ROM_UPPER.26 PROGRAM_COUNTER_UPPER.15 RAM1.1 RAM1.2 RAM1.3 RAM1.4 RAM1.5 RAM1.6 RAM1.7 RAM1.8 RAM1.9 RAM1.10 RAM1.11 RAM1.12 RAM1.13 RAM1.14 RAM1.15 RAM1.16 RAM1.17 RAM1.18 RAM1.19 RAM1.20 RAM1.21 RAM1.22 RAM1.23 RAM1.24 RAM1.25 RAM1.26 RAM1.27 RAM1.28 RESET_PC.2(S1) RESET_PC.3(P) RESET_REGS.2(S1) RESET_REGS.3(P) SELECTOR_BRANCH_.12(B:Y0) SELECTOR_LOGIC_.4(A:Y0) SELECTOR_LOGIC_.12(B:Y0) SELECTOR_PARAM_.4(A:Y0) SELECTOR_PARAM_.12(B:Y0) SELECTOR_STACK_.4(A:Y0) SELECTOR_STACK_.12(B:Y0) STEPPER_CLOCK.4(R) STEPPER_CLOCK.5(CV) X1.3

## Notes on the sheet
- 1  2  3 4  5  6  7 8
- CLK
- Clock
- Register A
- Calculation Register
- GND | VCC
- CLK
- Data
- Reg Calc OUT
- Reg Calc IN
- END CRNT CMD
- CALC_IN
- CALC_OUT
- SUM OUT | RAM_ADDR_IN
- SUBTRACT | RAM_WRITE
- CLOCK
- PC_IN
- PC_OUT
- PC_INC
- Flag IN
- Reg A OUT
- Reg A IN
- Memory OUT | Memory IN | Loop Ctrl A
- Reg A OUT
- Reg A IN | Loop Ctrl B
- Sub Count Load
- ~Data/Param
- RAM_IO
- ZF
- OF
- PF
- Parameter Register OUT
- Parameter Register IN
- OUT
- CLR REGISTERS
- Flag Out
- RAM Input Mode
- Stack POP | Parameter Register
- Stack PUSH
- RAM

## Power pins joined to a net without a drawn wire
GND: ADDER_LOWER.8(GND) ADDER_UPPER.8(GND) ADDR_MEM_REG_LOWER.8(GND) ADDR_MEM_REG_UPPER.8(GND) AND_GATE3_.7(P:GND) AND_GATE4_.7(P:GND) AND_GATE_.7(P:GND) FLAG_REG_LOWER.8(GND) FLAG_REG_UPPER.8(GND) INSTRUC_REGISTER_LOWER.8(GND) INSTRUC_REGISTER_UPPER.8(GND) KEYBOARD_SHIFT_LOWER.8(GND) KEYBOARD_SHIFT_UPPER.8(GND) NOR_GATE_.7(P:GND) NOT_GATE1_.7(P:GND) NOT_GATE2_.7(P:GND) NOT_GATE3_.7(P:GND) NOT_GATE4_.7(P:GND) NOT_GATE_.7(P:GND) OR_GATE_.7(P:GND) OUT_REG_LOWER.8(GND) OUT_REG_UPPER.8(GND) OUTPUT_BUFFER_ALU.10(GND) OUTPUT_BUFFER_CALC_REG.10(GND) OUTPUT_BUFFER_FLAGS.10(GND) OUTPUT_BUFFER_INSTRUCTION.10(GND) OUTPUT_BUFFER_KEYBOARD.10(GND) OUTPUT_BUFFER_MEMORY.10(GND) OUTPUT_BUFFER_PARAM_REG.10(GND) OUTPUT_BUFFER_PC.10(GND) OUTPUT_BUFFER_RAM.10(GND) OUTPUT_BUFFER_REG_A.10(GND) RAM_ADDR_LOWER.8(GND) RAM_ADDR_UPPER.8(GND) REG_A_LOWER.8(GND) REG_A_UPPER.8(GND) REG_CALC_LOWER.8(GND) REG_CALC_UPPER.8(GND) REG_PARAM_LOWER.8(GND) REG_PARAM_UPPER.8(GND) SELECTOR_BRANCH_.8(P:GND) SELECTOR_INSRUCTION_LOWER.8(GND) SELECTOR_INSRUCTION_UPPER.8(GND) SELECTOR_LOGIC_.8(P:GND) SELECTOR_PARAM_.8(P:GND) SELECTOR_STACK_.8(P:GND) SUBTRACT_INVRTR_LOWER_.7(P:GND) SUBTRACT_INVRTR_UPPER_.7(P:GND) XOR_GATE_1.7(P:GND) XOR_GATE_2.7(P:GND)
VCC: ADDER_LOWER.16(VCC) ADDER_UPPER.16(VCC) ADDR_MEM_REG_LOWER.16(VCC) ADDR_MEM_REG_UPPER.16(VCC) AND_GATE3_.14(P:VCC) AND_GATE4_.14(P:VCC) AND_GATE_.14(P:VCC) FLAG_REG_LOWER.16(VCC) FLAG_REG_UPPER.16(VCC) INSTRUC_REGISTER_LOWER.16(VCC) INSTRUC_REGISTER_UPPER.16(VCC) KEYBOARD_SHIFT_LOWER.16(VCC) KEYBOARD_SHIFT_UPPER.16(VCC) NOR_GATE_.14(P:VCC) NOT_GATE1_.14(P:VCC) NOT_GATE2_.14(P:VCC) NOT_GATE3_.14(P:VCC) NOT_GATE4_.14(P:VCC) NOT_GATE_.14(P:VCC) OR_GATE_.14(P:VCC) OUT_REG_LOWER.16(VCC) OUT_REG_UPPER.16(VCC) OUTPUT_BUFFER_ALU.20(VCC) OUTPUT_BUFFER_CALC_REG.20(VCC) OUTPUT_BUFFER_FLAGS.20(VCC) OUTPUT_BUFFER_INSTRUCTION.20(VCC) OUTPUT_BUFFER_KEYBOARD.20(VCC) OUTPUT_BUFFER_MEMORY.20(VCC) OUTPUT_BUFFER_PARAM_REG.20(VCC) OUTPUT_BUFFER_PC.20(VCC) OUTPUT_BUFFER_RAM.20(VCC) OUTPUT_BUFFER_REG_A.20(VCC) RAM_ADDR_LOWER.16(VCC) RAM_ADDR_UPPER.16(VCC) REG_A_LOWER.16(VCC) REG_A_UPPER.16(VCC) REG_CALC_LOWER.16(VCC) REG_CALC_UPPER.16(VCC) REG_PARAM_LOWER.16(VCC) REG_PARAM_UPPER.16(VCC) SELECTOR_BRANCH_.16(P:VCC) SELECTOR_INSRUCTION_LOWER.16(VCC) SELECTOR_INSRUCTION_UPPER.16(VCC) SELECTOR_LOGIC_.16(P:VCC) SELECTOR_PARAM_.16(P:VCC) SELECTOR_STACK_.16(P:VCC) SUBTRACT_INVRTR_LOWER_.14(P:VCC) SUBTRACT_INVRTR_UPPER_.14(P:VCC) XOR_GATE_1.14(P:VCC) XOR_GATE_2.14(P:VCC)
VDD: IC1.16(VDD)
VSS: IC1.8(VSS)

## Library data of the parts
4_INP_OR_GATE = 40xx:4072: Dual 4-input OR
ADDER_LOWER ADDER_UPPER = 74xx-eu:74*283: 4-bit binary FULL ADDER, fast carry
ADDR_MEM_REG_LOWER ADDR_MEM_REG_UPPER FLAG_REG_LOWER FLAG_REG_UPPER INSTRUC_REGISTER_LOWER INSTRUC_REGISTER_UPPER OUT_REG_LOWER OUT_REG_UPPER RAM_ADDR_LOWER RAM_ADDR_UPPER REG_A_LOWER REG_A_UPPER REG_CALC_LOWER REG_CALC_UPPER REG_PARAM_LOWER REG_PARAM_UPPER = 74xx-eu:74*173: 4-bit D type REGISTER, 3-state
AND_GATE3_ AND_GATE4_ AND_GATE_ = 74xx-eu:74*08: Quad 2-input AND gate
AUTO_CLOCK STEPPER_CLOCK = linear:*555: TIMER
C1-C4 = rcl:CPOL-EU: POLARIZED CAPACITOR, European symbol; SPICEPREFIX: C
CLK_MODE = special:SW_DIP-1: DIP SWITCH
CLK_TRIGGER RESET_PC RESET_REGS = switch-omron:10-XX: OMRON SWITCH; MPN: B3F-1000; OC_FARNELL: 176432; OC_NEWARK: 36M3542
CLOCK DATABUS_1-DATABUS_8 FLAG_1-FLAG_8 INVERTED_CLK_LED LED_A_REG_1-LED_A_REG_8 LED_B_REG_1-LED_B_REG_8 OVERFLOW_FLAG PARAM_LED_1-PARAM_LED_8 PC_1-PC_8 POSITIVE_FLAG RAM_LED_1-RAM_LED_8 USTEP_1-USTEP_5 ZERO_FLAG = led:LED: LED OSRAM: - CHIPLED LG R971, LG N971, LY N971, LG Q971, LY Q971, LO R971, LY R971 LH N974, LH R974 LS Q976, LO Q976, LY Q976 LO Q996 - Hyper CHIPLED LW Q18S LB Q993, LB Q99A, LB R99A - SideLED LS A670, LO A670, LY A670, LG A670, LP A670 LB A673, LV A673, LT A673, LW A673 LH A674 LY A675 LS A676, LA A676, LO A676, LY A676, LW A676 LS A679, LY A679, LG A679 - Hyper Micro SIDELED® LS Y876, LA Y876, LO Y876, LY Y876 LT Y87S - SmartLED LW L88C, LW L88S LB L89C, LB L89S, LG L890 LS L89K, LO L89K, LY L89K LS L896, LA L896, LO L896, LY L896 - TOPLED LS T670, LO T670, LY T670, LG T670, LP T670 LSG T670, LSP T670, LSY T670, LOP T670, LYG T670 LG T671, LOG T671, LSG T671 LB T673, LV T673, LT T673, LW T673 LH T674 LS T676, LA T676, LO T676, LY T676, LB T676, LH T676, LSB T676, LW T676 LB T67C, LV T67C, LT T67C, LS T67K, LO T67K, LY T67K, LW E67C LS E67B, LA E67B, LO E67B, LY E67B, LB E67C, LV E67C, LT E67C LW T67C LS T679, LY T679, LG T679 LS T770, LO T770, LY T770, LG T770, LP T770 LB T773, LV T773, LT T773, LW T773 LH T774 LS E675, LA E675, LY E675, LS T675 LS T776, LA T776, LO T776, LY T776, LB T776 LHGB T686 LT T68C, LB T68C - Hyper Mini TOPLED® LB M676 - Mini TOPLED Santana® LG M470 LS M47K, LO M47K, LY M47K Source: http://www.osram.convergy.de LUXEON: - LUMILED® LXK2-PW12-R00, LXK2-PW12-S00, LXK2-PW14-U00, LXK2-PW14-V00 LXK2-PM12-R00, LXK2-PM12-S00, LXK2-PM14-U00 LXK2-PE12-Q00, LXK2-PE12-R00, LXK2-PE12-S00, LXK2-PE14-T00, LXK2-PE14-U00 LXK2-PB12-K00, LXK2-PB12-L00, LXK2-PB12-M00, LXK2-PB14-N00, LXK2-PB14-P00, LXK2-PB14-Q00 LXK2-PR12-L00, LXK2-PR12-M00, LXK2-PR14-Q00, LXK2-PR14-R00 LXK2-PD12-Q00, LXK2-PD12-R00, LXK2-PD12-S00 LXK2-PH12-R00, LXK2-PH12-S00 LXK2-PL12-P00, LXK2-PL12-Q00, LXK2-PL12-R00 Source: www.luxeon.com KINGBRIGHT: KA-3528ASYC Source: www.kingbright.com
D1 = diode:1N4728: Z DIODE 3.3 V, 1W, 5 percent
EXTENSION = con-samtec:SSW-111-02-G-S: THROUGH-HOLE .025" SQ POST SOCKET Source: Samtec SSW.pdf; MF: Samtec Inc.; MPN: SSW-111-02-G-S; OC_FARNELL: unknown; OC_NEWARK: 11P9498
FREQUENCY = pot:TRIM_EU-: POTENTIOMETER
IC1 = 40xx:4161: Synchronous presettable 4-bit binary COUNTER
INSTRUCTION_MEMORY_0 INSTRUCTION_MEMORY_1 INSTRUCTION_MEMORY_2 KEYBOARD_ASCII_TABLE OUT_ROM_LOWER OUT_ROM_UPPER RAM RAM1 = ic-package:DIL28: Dual In Line
INSTRUCTIONS_EXTENSION = con-samtec:SSW-115-02-G-S: THROUGH-HOLE .025" SQ POST SOCKET Source: Samtec SSW.pdf; MF: Samtec Inc.; MPN: SSW-115-02-G-S; OC_FARNELL: unknown; OC_NEWARK: 11P9564
KEYBOARD = con-samtec:SSW-104-02-G-S: THROUGH-HOLE .025" SQ POST SOCKET Source: Samtec SSW.pdf; MF: Samtec Inc.; MPN: SSW-104-02-G-S; OC_FARNELL: unknown; OC_NEWARK: 11P9384
KEYBOARD_SHIFT_LOWER KEYBOARD_SHIFT_UPPER = 74xx-eu:74*595: 8-bit SHIFT REGISTER, output latch
MEMORY = con-3m:228-?00-0602J: Zero Insertion Force Socked Source: http://www.3M.com/ehpd; MF: 3M; MPN: 228-1277-00-0602J; OC_FARNELL: 9897356; OC_NEWARK: 85K7825
MICRO_COUNTER_LOWER MICRO_COUNTER_UPPER PROGRAM_COUNTER_LOWER PROGRAM_COUNTER_UPPER = ic-package:DIL16: Dual In Line / Socket
NOR_GATE_ = 74xx-eu:74*02: Quad 2-input NOR gate
NOT_GATE1_ NOT_GATE2_ NOT_GATE3_ NOT_GATE_ = 74xx-eu:74*04: Hex INVERTER
NOT_GATE4_ = 74xx-eu:74*04: Hex INVERTER; SPICEPREFIX: B
OR_GATE_ = 74xx-eu:74*32: Quad 2-input OR gate
OUT_SEGMENT_LOWER OUT_SEGMENT_UPPER = special:7SEG-CK: 7-segment DISPLAY single cathode, 13 mm
OUTPUT_BUFFER_ALU OUTPUT_BUFFER_CALC_REG OUTPUT_BUFFER_FLAGS OUTPUT_BUFFER_KEYBOARD OUTPUT_BUFFER_MEMORY OUTPUT_BUFFER_PARAM_REG OUTPUT_BUFFER_PC OUTPUT_BUFFER_RAM OUTPUT_BUFFER_REG_A = 74xx-eu:74*245: Octal BUS TRANSCEIVER, 3-state
OUTPUT_BUFFER_INSTRUCTION = 74xx-us:74*245: Octal BUS TRANSCEIVER, 3-state
R1-R45 R53-R81 = rcl:R-US_: RESISTOR, American symbol; SPICEPREFIX: R
SELECTOR_BRANCH_ SELECTOR_LOGIC_ SELECTOR_PARAM_ SELECTOR_STACK_ = 74xx-eu:74*139: Dual 2-line to 4-line DECODER/DEMULTIPLEXER
SELECTOR_INSRUCTION_LOWER SELECTOR_INSRUCTION_UPPER = 74xx-eu:74*157: Quadruple 2-line to 1-line data SELECTOR/MULTIPLEXER
SUBTRACT_INVRTR_LOWER_ SUBTRACT_INVRTR_UPPER_ XOR_GATE_1 XOR_GATE_2 = 74xx-eu:74*86: Quad 2-input EXCLUSIVE-OR (XOR) gate
X1 = con-samtec:SSW-103-02-G-S: THROUGH-HOLE .025" SQ POST SOCKET Source: Samtec SSW.pdf; MF: Samtec Inc.; MPN: SSW-103-02-G-S; OC_FARNELL: unknown; OC_NEWARK: 11P9367
ZERO_POS_FLAG_IDENTIFIER = 74ttl-din:74*4078: 8-input OR/NOR, complementary outputs